# Altium project UltraZohm_Analog_ADS5272.PrjPcb (part 1 of 2)
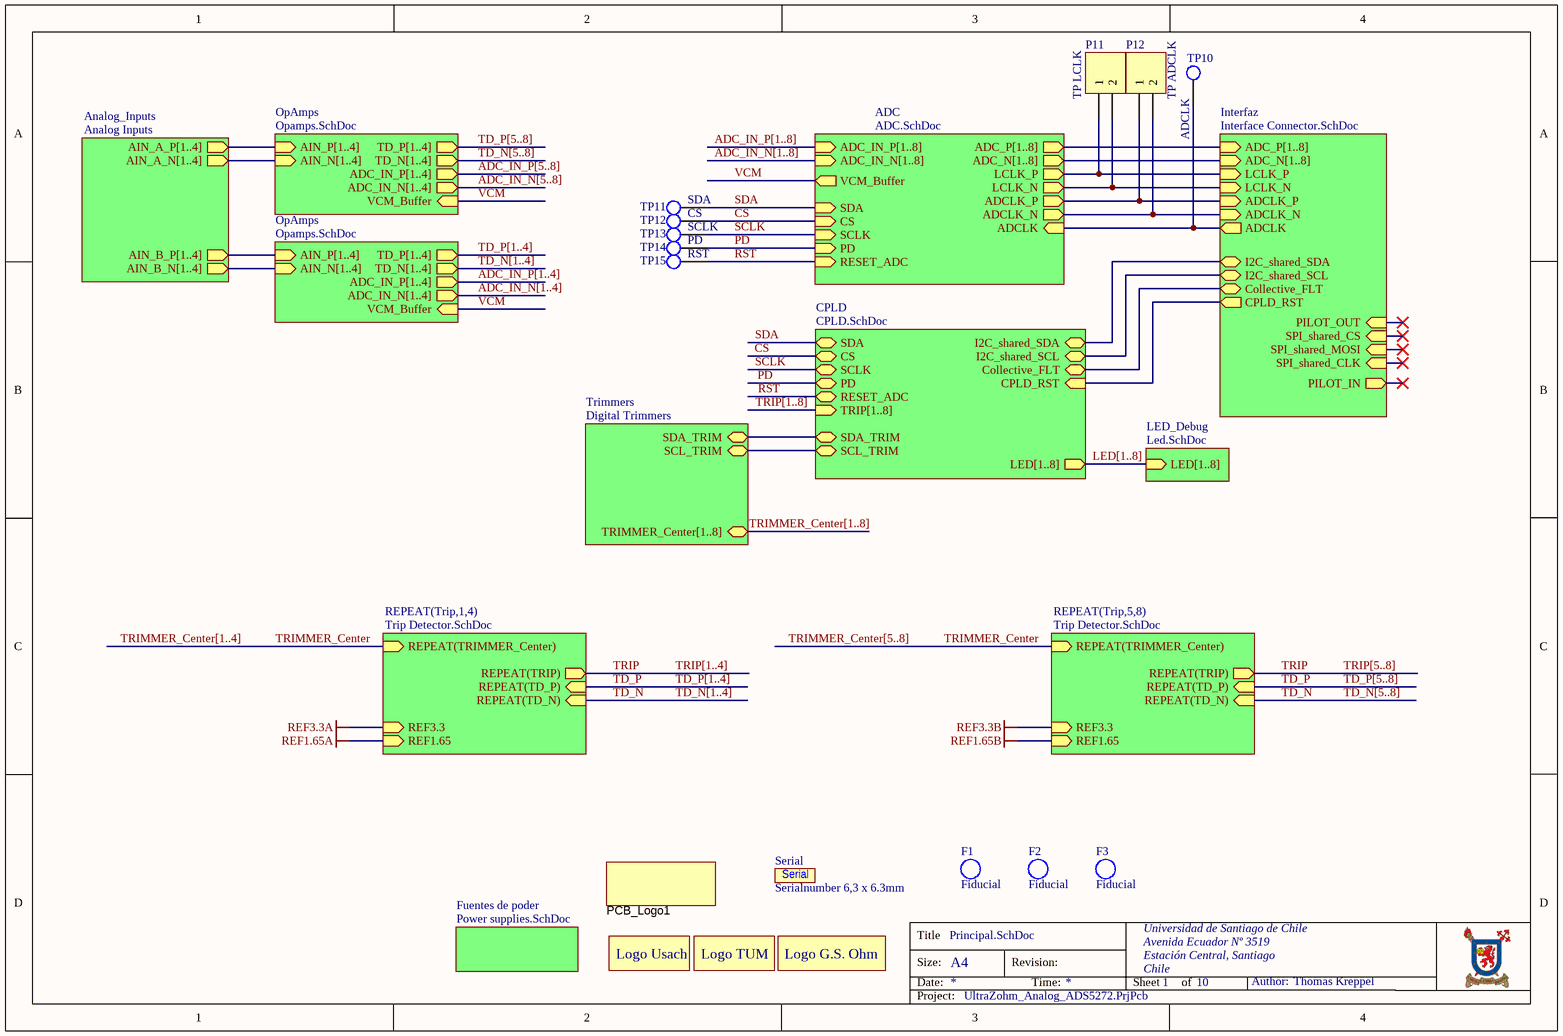
[diagram p0: Principal.SchDoc]
ProjectRevision: 3v01
10 sheets, 337 parts. Net scope: hierarchical (ports join the sheet entries above them; power ports are global).
Board file: UltraZohm_Analog_ADS5272.PcbDoc
Sheets:
  Principal.SchDoc
    ADC = ADC.SchDoc
    Fuentes de poder = Power supplies.SchDoc
    Interfaz = Interface Connector.SchDoc
    Trip1 = Trip Detector.SchDoc
    Trip2 = Trip Detector.SchDoc
    Trip3 = Trip Detector.SchDoc
    Trip4 = Trip Detector.SchDoc
    Trimmers = Digital Trimmers.SchDoc
    Analog_Inputs = Analog Inputs.SchDoc
    CPLD = CPLD.SchDoc
    LED_Debug = Led.SchDoc
    OpAmps = Opamps.SchDoc
    OpAmps = Opamps.SchDoc
    Trip5 = Trip Detector.SchDoc
    Trip6 = Trip Detector.SchDoc
    Trip7 = Trip Detector.SchDoc
    Trip8 = Trip Detector.SchDoc

## Sheet Principal.SchDoc
size A4; Author: Thomas Kreppel; CompanyName: Universidad de Santiago de Chile; Address1: Avenida Ecuador Nº 3519; Address2: Estación Central, Santiago; Address3: Chile; DocumentNumber: 1; Revision: 3v01; SheetNumber: 1; SheetTotal: 10

### Parts
F1  Fiducial  [Fiducial_1.7mm]  (no BOM)
F2  Fiducial  [Fiducial_1.7mm]  (no BOM)
F3  Fiducial  [Fiducial_1.7mm]  (no BOM)
Logo1  LOGO USACH  [Logo Usach]  (value not drawn)  (no BOM)
Logo2  LOGO TUM  [Logo TUM]  (value not drawn)  (no BOM)
Logo3  LOGO G.S. Ohm  [Logo G.S.Ohm University]  (value not drawn)  (no BOM)
P11  TP LCLK  [HDR1X2]  (no BOM)
P12  TP ADCLK  [HDR1X2]  (no BOM)
PCB_Logo1  ESD Susceptible  [ESD_Overlay_Medium]  (value not drawn)  (no BOM)
Serial  Serialnumber 6,3 x 6.3mm  [Serial_6.3x6.3mm]  (no BOM)
TP10  ADCLK  [TP_1.6mm]  (no BOM)
TP11  SDA  [TP_1.6mm]  (no BOM)
TP12  CS  [TP_1.6mm]  (no BOM)
TP13  SCLK  [TP_1.6mm]  (no BOM)
TP14  PD  [TP_1.6mm]  (no BOM)
TP15  RST  [TP_1.6mm]  (no BOM)

### Sub-sheets
ADC = ADC.SchDoc: ADCLK_P (out), LCLK_P (out), LCLK_N (out), ADCLK_N (out), ADCLK (in), SDA (in), SCLK (in), CS (in), PD (in), RESET_ADC (in), ADC_P[1..8] (out), ADC_N[1..8] (out), VCM_Buffer (out), ADC_IN_N[1..8] (in), ADC_IN_P[1..8] (in)
Analog_Inputs = Analog Inputs: AIN_B_P[1..4] (out), AIN_B_N[1..4] (out), AIN_A_P[1..4] (out), AIN_A_N[1..4] (out)
CPLD = CPLD.SchDoc: SDA_TRIM (bidir), SCL_TRIM (bidir), TRIP[1..8] (in), LED[1..8] (out), SDA (bidir), SCLK (bidir), CS (bidir), PD (bidir), RESET_ADC (bidir), Collective_FLT (bidir), I2C_shared_SDA (bidir), I2C_shared_SCL (bidir), CPLD_RST (in)
Fuentes de poder = Power supplies.SchDoc: no entries
Interfaz = Interface Connector.SchDoc: ADCLK_P (in), LCLK_P (in), LCLK_N (in), ADCLK_N (in), ADCLK (out), ADC_P[1..8] (in), ADC_N[1..8] (in), Collective_FLT (bidir), I2C_shared_SDA (bidir), I2C_shared_SCL (bidir), SPI_shared_CS (in), SPI_shared_MOSI (in), PILOT_OUT (in), PILOT_IN (out), SPI_shared_CLK (in), CPLD_RST (out)
LED_Debug = Led.SchDoc: LED[1..8] (in)
OpAmps = Opamps.SchDoc: ADC_IN_P[1..4] (out), TD_P[1..4] (out), AIN_P[1..4] (in), AIN_N[1..4] (in), ADC_IN_N[1..4] (out), TD_N[1..4] (out), VCM_Buffer (in)
OpAmps = Opamps.SchDoc: TD_P[1..4] (out), TD_N[1..4] (out), VCM_Buffer (in), AIN_N[1..4] (in), ADC_IN_N[1..4] (out), AIN_P[1..4] (in), ADC_IN_P[1..4] (out)
REPEAT(Trip,1,4) = Trip Detector.SchDoc: REPEAT(TRIMMER_Center) (in), REPEAT(TRIP) (out), REPEAT(TD_P) (in), REPEAT(TD_N) (in), REF3.3 (in), REF1.65 (in)
REPEAT(Trip,5,8) = Trip Detector.SchDoc: REPEAT(TRIMMER_Center) (in), REPEAT(TRIP) (out), REPEAT(TD_P) (in), REPEAT(TD_N) (in), REF3.3 (in), REF1.65 (in)
Trimmers = Digital Trimmers: SDA_TRIM (bidir), SCL_TRIM (bidir), TRIMMER_Center[1..8] (bidir)

### Nets
ADCLK: TP10.1 ; sheet ADC/ADCLK, sheet Interfaz/ADCLK
ADCLK_N: P12.2 ; sheet ADC/ADCLK_N, sheet Interfaz/ADCLK_N
ADCLK_P: P12.1 ; sheet ADC/ADCLK_P, sheet Interfaz/ADCLK_P
Collective_FLT: sheet Interfaz/Collective_FLT, sheet CPLD/Collective_FLT
CPLD_RST: sheet Interfaz/CPLD_RST, sheet CPLD/CPLD_RST
CS: TP12.1 ; sheet ADC/CS, sheet CPLD/CS
I2C_shared_SCL: sheet Interfaz/I2C_shared_SCL, sheet CPLD/I2C_shared_SCL
I2C_shared_SDA: sheet Interfaz/I2C_shared_SDA, sheet CPLD/I2C_shared_SDA
LCLK_N: P11.2 ; sheet ADC/LCLK_N, sheet Interfaz/LCLK_N
LCLK_P: P11.1 ; sheet ADC/LCLK_P, sheet Interfaz/LCLK_P
PD: TP14.1 ; sheet ADC/PD, sheet CPLD/PD
RST: TP15.1 ; sheet ADC/RESET_ADC, sheet CPLD/RESET_ADC  [project net RESET_ADC]
SCL_TRIM: sheet Trimmers/SCL_TRIM, sheet CPLD/SCL_TRIM
SCLK: TP13.1 ; sheet ADC/SCLK, sheet CPLD/SCLK
SDA: TP11.1 ; sheet ADC/SDA, sheet CPLD/SDA
SDA_TRIM: sheet Trimmers/SDA_TRIM, sheet CPLD/SDA_TRIM
TD_N: sheet REPEAT(Trip,1,4)/REPEAT(TD_N), sheet REPEAT(Trip,5,8)/REPEAT(TD_N)
TD_P: sheet REPEAT(Trip,1,4)/REPEAT(TD_P), sheet REPEAT(Trip,5,8)/REPEAT(TD_P)
TRIMMER_Center: sheet REPEAT(Trip,1,4)/REPEAT(TRIMMER_Center), sheet REPEAT(Trip,5,8)/REPEAT(TRIMMER_Center)
TRIP: sheet REPEAT(Trip,1,4)/REPEAT(TRIP), sheet REPEAT(Trip,5,8)/REPEAT(TRIP)
VCM: sheet ADC/VCM_Buffer, sheet OpAmps/VCM_Buffer, sheet OpAmps/VCM_Buffer  [project net VC]

### Buses and harness runs
bus ADC_IN_N[1..4] = sheet OpAmps/ADC_IN_N[1..4]
bus ADC_IN_N[1..8] = sheet ADC/ADC_IN_N[1..8]
bus ADC_IN_N[5..8] = sheet OpAmps/ADC_IN_N[1..4]
bus ADC_IN_P[1..4] = sheet OpAmps/ADC_IN_P[1..4]
bus ADC_IN_P[1..8] = sheet ADC/ADC_IN_P[1..8]
bus ADC_IN_P[5..8] = sheet OpAmps/ADC_IN_P[1..4]
bus LED[1..8] = sheet CPLD/LED[1..8] = sheet LED_Debug/LED[1..8]
bus sheet ADC/ADC_N[1..8] = sheet Interfaz/ADC_N[1..8]
bus sheet ADC/ADC_P[1..8] = sheet Interfaz/ADC_P[1..8]
bus sheet Analog_Inputs/AIN_A_N[1..4] = sheet OpAmps/AIN_N[1..4]
bus sheet Analog_Inputs/AIN_A_P[1..4] = sheet OpAmps/AIN_P[1..4]
bus sheet Analog_Inputs/AIN_B_N[1..4] = sheet OpAmps/AIN_N[1..4]
bus sheet Analog_Inputs/AIN_B_P[1..4] = sheet OpAmps/AIN_P[1..4]
bus TD_N[1..4]
bus TD_N[1..4] = sheet OpAmps/TD_N[1..4]
bus TD_N[5..8]
bus TD_N[5..8] = sheet OpAmps/TD_N[1..4]
bus TD_P[1..4]
bus TD_P[1..4] = sheet OpAmps/TD_P[1..4]
bus TD_P[5..8]
bus TD_P[5..8] = sheet OpAmps/TD_P[1..4]
bus TRIMMER_Center[1..4]
bus TRIMMER_Center[1..8] = sheet Trimmers/TRIMMER_Center[1..8]
bus TRIMMER_Center[5..8]
bus TRIP[1..4]
bus TRIP[1..8] = sheet CPLD/TRIP[1..8]
bus TRIP[5..8]

### Notes on the sheet
- Title
- Size:
- Date:
- A4
- Revision:
- Time:
- Sheet
- of
- Author:
- Project:
- (in symbol LOGO G.S. Ohm) Logo G.S. Ohm
- (in symbol LOGO TUM) Logo TUM
- (in symbol LOGO USACH) Logo Usach

### Library data of the parts
F1-F3 = Fiducial: Fiducial for Assembler
P11 P12 = Header 2: Header, 2-Pin; LatestRevisionDate: 17-Jul-2002; LatestRevisionNote: Re-released for DXP Platform.; Publisher: Altium Limited
PCB_Logo1 = LOGO_ESD_Susceptible: ESD Susceptible Symbol; Created: 2018_11_25_AGeiger; Value: ESD Susceptible
Serial = SerialNumber: Created: 2018_09_18_AGeiger; Value: Serialnumber 6,3 x 6.3mm
TP10-TP15 = TP: 1.6mm Test Point Keystone; MPN: 5006; Created: 2020_04_Kreppel; MF: Keystone; Supplier 1: Digikey; Supplier Part Number 1: 36-5006-ND
Logo1 = LOGO USACH: Supplier 2: Mouser
Logo2 = LOGO TUM: Supplier 2: Mouser
Logo3 = LOGO G.S. Ohm: Supplier 2: Mouser

## Sheet ADC.SchDoc
size A4; Author: Thomas Kreppel; CompanyName: Universidad de Santiago de Chile; Address1: Avenida Ecuador Nº 3519; Address2: Estación Central, Santiago; Address3: Chile; DocumentNumber: 6; Revision: 3v01; SheetNumber: 6; SheetTotal: 10
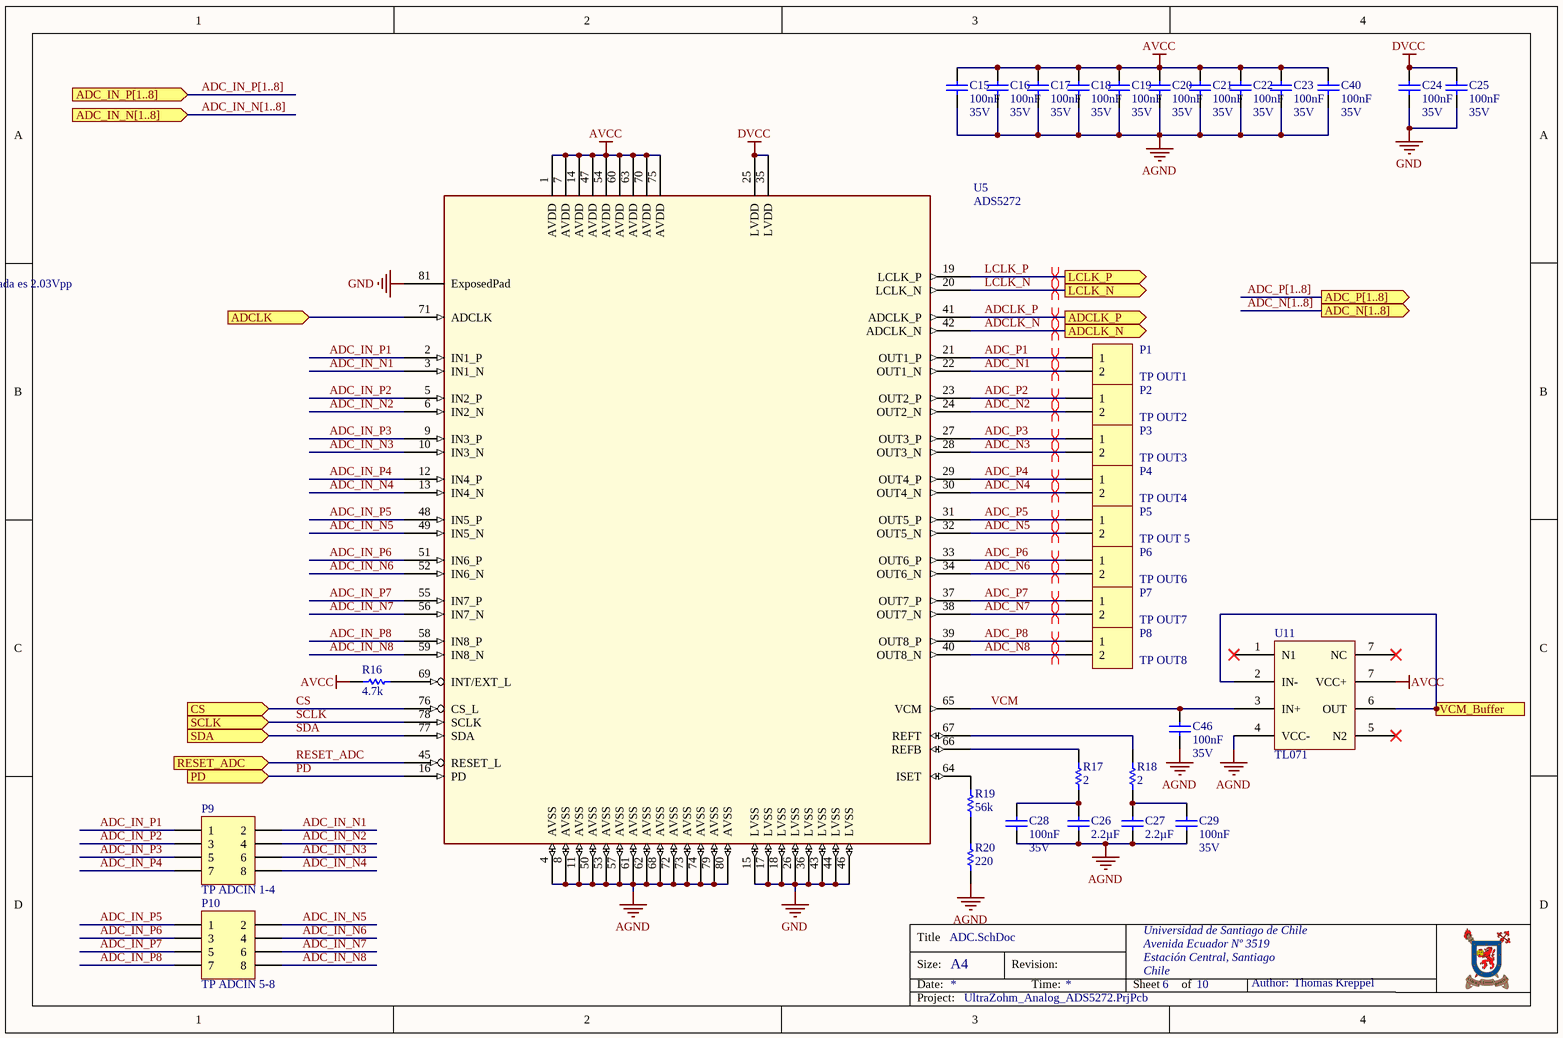
[diagram p1: ADC.SchDoc]

### Parts
C15  100nF  Voltage: 35V  [CAP_0603]
C16  100nF  Voltage: 35V  [CAP_0603]
C17  100nF  Voltage: 35V  [CAP_0603]
C18  100nF  Voltage: 35V  [CAP_0603]
C19  100nF  Voltage: 35V  [CAP_0603]
C20  100nF  Voltage: 35V  [CAP_0603]
C21  100nF  Voltage: 35V  [CAP_0603]
C22  100nF  Voltage: 35V  [CAP_0603]
C23  100nF  Voltage: 35V  [CAP_0603]
C24  100nF  Voltage: 35V  [CAP_0603]
C25  100nF  Voltage: 35V  [CAP_0603]
C26  2.2µF  [CAP_0603]
C27  2.2µF  [CAP_0603]
C28  100nF  Voltage: 35V  [CAP_0603]
C29  100nF  Voltage: 35V  [CAP_0603]
C40  100nF  Voltage: 35V  [CAP_0603]
C46  100nF  Voltage: 35V  [CAP_0603]
P1  TP OUT1  [HDR1X2]  (no BOM)
P2  TP OUT2  [HDR1X2]  (no BOM)
P3  TP OUT3  [HDR1X2]  (no BOM)
P4  TP OUT4  [HDR1X2]  (no BOM)
P5  TP OUT 5  [HDR1X2]  (no BOM)
P6  TP OUT6  [HDR1X2]  (no BOM)
P7  TP OUT7  [HDR1X2]  (no BOM)
P8  TP OUT8  [HDR1X2]  (no BOM)
P9  TP ADCIN 1-4  [HDR2X4]  (no BOM)
P10  TP ADCIN 5-8  [HDR2X4]  (no BOM)
R16  4.7k  [RES_0603]
R17  2  [RES_0603]
R18  2  [RES_0603]
R19  56k  [RES_0603]
R20  220  [RES_0603]
U5  ADS5272  [TSQFP50P1400X1400_HS-80M]
U11  TL071  [SOIC8_N]

### Ports
ADC_IN_N[1..8] (in), ADC_IN_P[1..8] (in), ADC_N[1..8] (out), ADC_P[1..8] (out), ADCLK (in), ADCLK_N (out), ADCLK_P (out), CS (in), LCLK_N (out), LCLK_P (out), PD (in), RESET_ADC (in), SCLK (in), SDA (in), VCM_Buffer (out)

### Nets
AGND: C15.2 C16.2 C17.2 C18.2 C19.2 C20.2 C21.2 C22.2 C23.2 C26.2 C27.2 C28.2 C29.2 C40.2 C46.2 R20.1 U5.4(AVSS) U5.8(AVSS) U5.11(AVSS) U5.50(AVSS) U5.53(AVSS) U5.57(AVSS) U5.61(AVSS) U5.62(AVSS) U5.68(AVSS) U5.72(AVSS) U5.73(AVSS) U5.74(AVSS) U5.79(AVSS) U5.80(AVSS) U11.4(VCC-)
AVCC: C15.1 C16.1 C17.1 C18.1 C19.1 C20.1 C21.1 C22.1 C23.1 C40.1 R16.2 U5.1(AVDD) U5.7(AVDD) U5.14(AVDD) U5.47(AVDD) U5.54(AVDD) U5.60(AVDD) U5.63(AVDD) U5.70(AVDD) U5.75(AVDD) U11.7(VCC+)
DVCC: C24.1 C25.1 U5.25(LVDD) U5.35(LVDD)
GND: C24.2 C25.2 U5.15(LVSS) U5.17(LVSS) U5.18(LVSS) U5.26(LVSS) U5.36(LVSS) U5.43(LVSS) U5.44(LVSS) U5.46(LVSS) U5.81(ExposedPad)
ADC_IN_N1: P9.2 U5.3(IN1_N)  [project net ADC_IN1_N]
ADC_IN_N2: P9.4 U5.6(IN2_N)  [project net ADC_IN2_N]
ADC_IN_N3: P9.6 U5.10(IN3_N)  [project net ADC_IN3_N]
ADC_IN_N4: P9.8 U5.13(IN4_N)  [project net ADC_IN4_N]
ADC_IN_N5: P10.2 U5.49(IN5_N)  [project net ADC_IN1_N]
ADC_IN_N6: P10.4 U5.52(IN6_N)  [project net ADC_IN2_N]
ADC_IN_N7: P10.6 U5.56(IN7_N)  [project net ADC_IN3_N]
ADC_IN_N8: P10.8 U5.59(IN8_N)  [project net ADC_IN4_N]
ADC_IN_P1: P9.1 U5.2(IN1_P)  [project net ADC_IN1_P]
ADC_IN_P2: P9.3 U5.5(IN2_P)  [project net ADC_IN2_P]
ADC_IN_P3: P9.5 U5.9(IN3_P)  [project net ADC_IN3_P]
ADC_IN_P4: P9.7 U5.12(IN4_P)  [project net ADC_IN4_P]
ADC_IN_P5: P10.1 U5.48(IN5_P)  [project net ADC_IN1_P]
ADC_IN_P6: P10.3 U5.51(IN6_P)  [project net ADC_IN2_P]
ADC_IN_P7: P10.5 U5.55(IN7_P)  [project net ADC_IN3_P]
ADC_IN_P8: P10.7 U5.58(IN8_P)  [project net ADC_IN4_P]
ADC_N1: P1.2 U5.22(OUT1_N)
ADC_N2: P2.2 U5.24(OUT2_N)
ADC_N3: P3.2 U5.28(OUT3_N)
ADC_N4: P4.2 U5.30(OUT4_N)
ADC_N5: P5.2 U5.32(OUT5_N)
ADC_N6: P6.2 U5.34(OUT6_N)
ADC_N7: P7.2 U5.38(OUT7_N)
ADC_N8: P8.2 U5.40(OUT8_N)
ADC_P1: P1.1 U5.21(OUT1_P)
ADC_P2: P2.1 U5.23(OUT2_P)
ADC_P3: P3.1 U5.27(OUT3_P)
ADC_P4: P4.1 U5.29(OUT4_P)
ADC_P5: P5.1 U5.31(OUT5_P)
ADC_P6: P6.1 U5.33(OUT6_P)
ADC_P7: P7.1 U5.37(OUT7_P)
ADC_P8: P8.1 U5.39(OUT8_P)
ADCLK: U5.71(ADCLK) ; port ADCLK
ADCLK_N: U5.42(ADCLK_N) ; port ADCLK_N
ADCLK_P: U5.41(ADCLK_P) ; port ADCLK_P
CS: U5.76(CS_L) ; port CS
LCLK_N: U5.20(LCLK_N) ; port LCLK_N
LCLK_P: U5.19(LCLK_P) ; port LCLK_P
PD: U5.16(PD) ; port PD
RESET_ADC: U5.45(RESET_L) ; port RESET_ADC
SCLK: U5.78(SCLK) ; port SCLK
SDA: U5.77(SDA) ; port SDA
VC: U11.2(IN-) U11.6(OUT) ; port VCM_Buffer
VCM: C46.1 U5.65(VCM) U11.3(IN+)
NetC26_1: C26.1 C28.1 R17.1
NetC27_1: C27.1 C29.1 R18.1
NetR16_1: R16.1 U5.69(INT/EXT_L)
NetR17_2: R17.2 U5.66(REFB)
NetR18_2: R18.2 U5.67(REFT)
NetR19_1: R19.1 R20.2
NetR19_2: R19.2 U5.64(ISET)

Not connected (* = marked no-connect by the designer): U11 1(N1)* 5(N2)*

### Buses and harness runs
bus ADC_IN_N[1..8] = port ADC_IN_N[1..8]
bus ADC_IN_P[1..8] = port ADC_IN_P[1..8]
bus ADC_N[1..8] = port ADC_N[1..8]
bus ADC_P[1..8] = port ADC_P[1..8]

### Layout directives
differential pair: ADC_N1, ADC_N2, ADC_N3, ADC_N4, ADC_N5, ADC_N6, ADC_N7, ADC_N8, ADC_P1, ADC_P2, ADC_P3, ADC_P4, ADC_P5, ADC_P6, ADC_P7, ADC_P8, ADCLK_N, ADCLK_P, LCLK_N, LCLK_P

### Notes on the sheet
- Tension diferencial máxima en la entrada es 2.03Vpp
- Title
- Size:
- Date:
- A4
- Revision:
- Time:
- Sheet
- of
- Author:
- Project:

### Library data of the parts
C15-C25 C28 C29 C40 C46 = Cap_0603: Capacitor; MPN: C0603C104M5RACTU; Rule: PcbType=ProtelPcb; MF: KEMET; Dielectricum: X7R; Tolerance: 10%; Published: 8-Jun-2000; LatestRevisionDate: 17-Jul-2002; LatestRevisionNote: Re-released for DXP Platform.; PackageReference: RAD-0.3; Publisher: Altium Limited; Value: 100nF; Supplier 1: Digikey; Supplier 2: Mouser; Supplier Part Number 1: 399-7845-1-ND; Package: 0603
C26 C27 = Cap_0603: Capacitor; MPN: C0603C225K8RACTU; Rule: PcbType=ProtelPcb; MF: KEMET; Voltage: 10V; Dielectricum: X7R; Tolerance: 10%; Published: 8-Jun-2000; LatestRevisionDate: 17-Jul-2002; LatestRevisionNote: Re-released for DXP Platform.; PackageReference: RAD-0.3; Publisher: Altium Limited; Value: 2.2µF; Supplier 1: Digikey; Supplier 2: Mouser; Supplier Part Number 1: 399-11681-1-ND; Package: 0603
P1-P8 = Header 2: Header, 2-Pin; LatestRevisionDate: 17-Jul-2002; LatestRevisionNote: Re-released for DXP Platform.; Publisher: Altium Limited
P9 P10 = Header 4X2: Header, 4-Pin, Dual row; LatestRevisionDate: 17-Jul-2002; LatestRevisionNote: Re-released for DXP Platform.; Publisher: Altium Limited
R16 = Res0603: Manufacturer Part-Number: RC0603FR-074K7L; Tolerance: 1%; Published: 8-Jun-2000; LatestRevisionDate: 17-Jul-2002; LatestRevisionNote: Re-released for DXP Platform.; PackageReference: AXIAL-0.3; Publisher: Altium Limited; PackageDescription: Axial Device, Thru-Hole; 2 Leads; 0.3 in Pin Spacing; Value: 4.7k; Supplier 1: Digikey; Supplier 2: Mouser; Supplier Part Number 1: 311-4.70KHRCT-ND; Package: 0603
R17 R18 = Res0603: Manufacturer Part-Number: RC0603FR-072RL; Tolerance: 1%; Published: 8-Jun-2000; LatestRevisionDate: 17-Jul-2002; LatestRevisionNote: Re-released for DXP Platform.; PackageReference: AXIAL-0.3; Publisher: Altium Limited; PackageDescription: Axial Device, Thru-Hole; 2 Leads; 0.3 in Pin Spacing; Value: 2; Supplier 1: Digikey; Supplier 2: Mouser; Supplier Part Number 1: 311-2.00HRCT-ND; Package: 0603
R19 = Res0603: Manufacturer Part-Number: RT0603DRD0756KL; Tolerance: 1%; Published: 8-Jun-2000; LatestRevisionDate: 17-Jul-2002; LatestRevisionNote: Re-released for DXP Platform.; PackageReference: AXIAL-0.3; Publisher: Altium Limited; PackageDescription: Axial Device, Thru-Hole; 2 Leads; 0.3 in Pin Spacing; Value: 56k; Supplier 1: Digikey; Supplier 2: Mouser; Supplier Part Number 1: 311-56KDCT-ND; Package: 0603
R20 = Res0603: Manufacturer Part-Number: RC0603JR-07220RL; Tolerance: 1%; Published: 8-Jun-2000; LatestRevisionDate: 17-Jul-2002; LatestRevisionNote: Re-released for DXP Platform.; PackageReference: AXIAL-0.3; Publisher: Altium Limited; PackageDescription: Axial Device, Thru-Hole; 2 Leads; 0.3 in Pin Spacing; Value: 220; Supplier 1: Digikey; Supplier 2: Mouser; Supplier Part Number 1: 311-220GRCT-ND; Package: 0603
U5 = ADS5272: Manufacturer Part-Number: ADS5272IPFP; Supplier 1: Digikey; Supplier 2: Mouser; Supplier Part Number 1: 296-18605-ND
U11 = TL071: IC OPAMP JFET 3MHZ 8SOIC; Manufacturer Part-Number: TL071CDR; Supplier 1: Digikey; Supplier 2: Mouser; Supplier Part Number 1: 296-14994-1-ND

## Sheet Power supplies.SchDoc
size A4; Author: Thomas Kreppel; CompanyName: Universidad de Santiago de Chile; Address1: Avenida Ecuador Nº 3519; Address2: Estación Central, Santiago; Address3: Chile; DocumentNumber: 3; Revision: 3v01; SheetNumber: 3; SheetTotal: 10
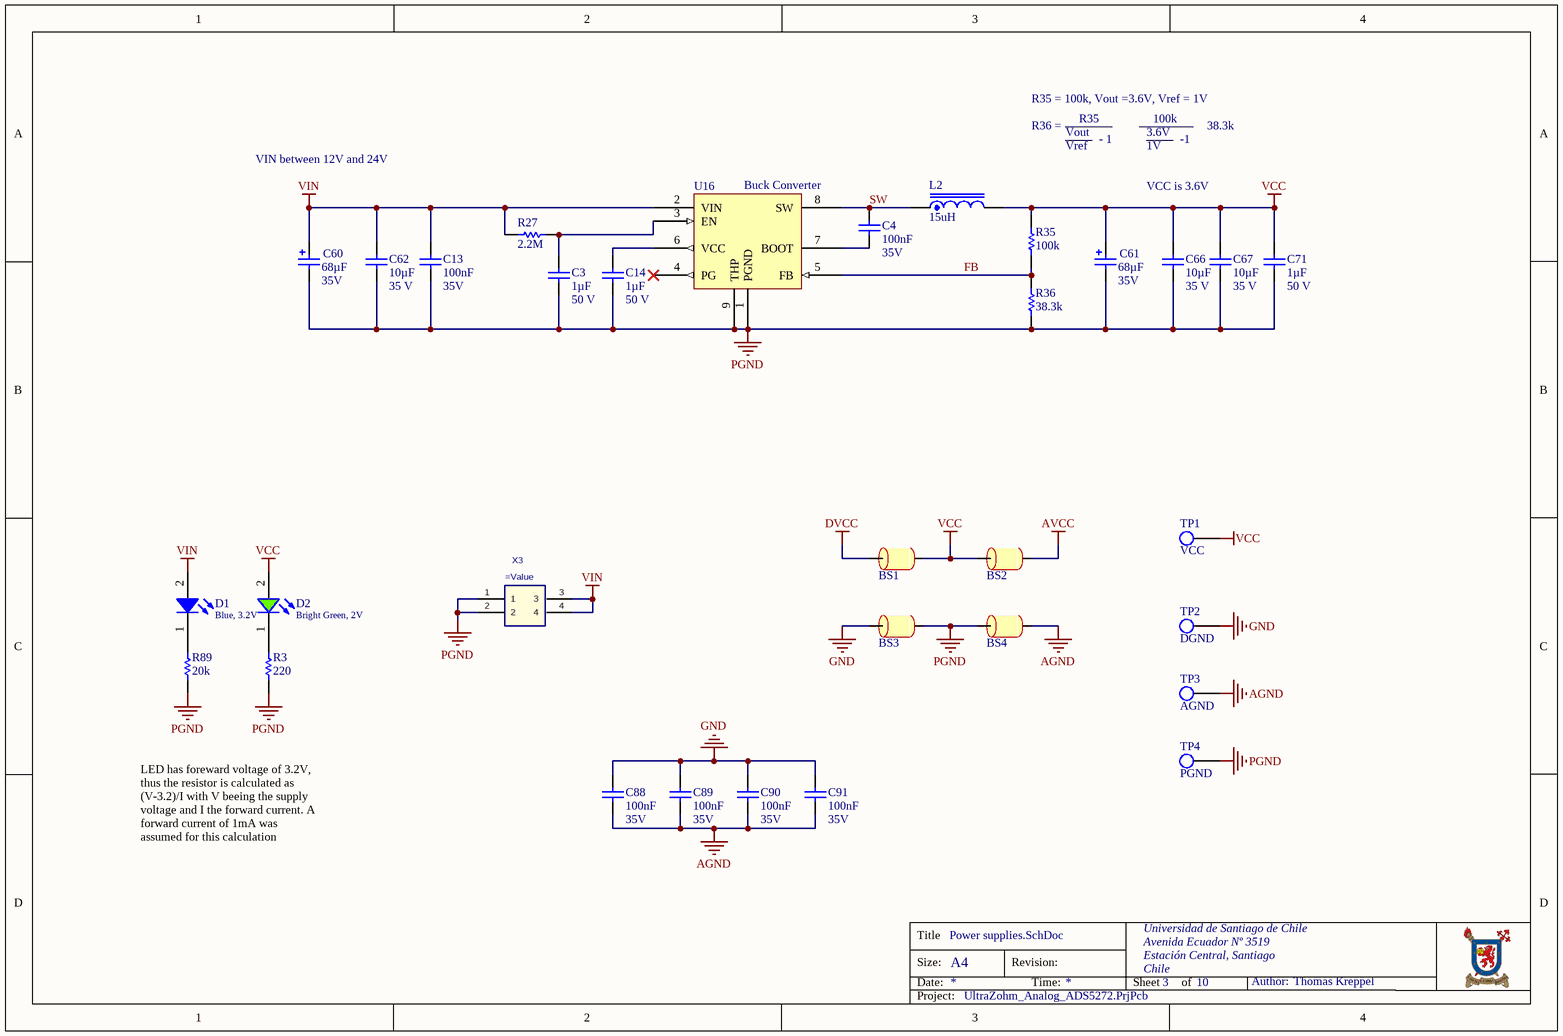
[diagram p2: Power supplies.SchDoc]

### Parts
BS1  Ferrite bead  [RES_1206]  (value not drawn)
BS2  Ferrite bead  [RES_1206]  (value not drawn)
BS3  Ferrite bead  [RES_1206]  (value not drawn)
BS4  Ferrite bead  [RES_1206]  (value not drawn)
C3  1µF  Voltage: 50 V  [CAP_0603]
C4  100nF  Voltage: 35V  [CAP_0603]
C13  100nF  Voltage: 35V  [CAP_0603]
C14  1µF  Voltage: 50 V  [CAP_0603]
C60  68µF  Voltage: 35V  [WCAP-ATG8_6.3x11]
C61  68µF  Voltage: 35V  [WCAP-ATG8_6.3x11]
C62  10µF  Voltage: 35 V  [RES_1206]
C66  10µF  Voltage: 35 V  [RES_1206]
C67  10µF  Voltage: 35 V  [RES_1206]
C71  1µF  Voltage: 50 V  [CAP_0603]
C88  100nF  Voltage: 35V  [CAP_0603]
C89  100nF  Voltage: 35V  [CAP_0603]
C90  100nF  Voltage: 35V  [CAP_0603]
C91  100nF  Voltage: 35V  [CAP_0603]
D1  Blue, 3.2V  [WL-SMCW_0603_H=0.7mm]
D2  Bright Green, 2V  [WL-SMCW_0603_H=0.7mm]
L2  15uH  [SMT_inductor_1050_Performance]
R3  220  [RES_0603]
R27  2.2M  [RES_0603]
R35  100k  [RES_0603]
R36  38.3k  [RES_0603]
R89  20k  [RES_0603]
TP1  VCC  [TP_1.6mm]  (no BOM)
TP2  DGND  [TP_1.6mm]  (no BOM)
TP3  AGND  [TP_1.6mm]  (no BOM)
TP4  PGND  [TP_1.6mm]  (no BOM)
U16  Buck Converter  [SOIC127P600X170_HS-9N]
X3  (no value)  [IPL1-102-01-L-D-K]

### Nets
AGND: BS4.2 C88.2 C89.2 C90.2 C91.2 TP3.1
AVCC: BS2.2
DVCC: BS1.1
GND: BS3.1 C88.1 C89.1 C90.1 C91.1 TP2.1
PGND: BS3.2 BS4.1 C3.2 C13.2 C14.2 C60.1(N) C61.1(N) C62.2 C66.2 C67.2 C71.2 R3.1 R36.1 R89.2 TP4.1 U16.1(PGND) U16.9(THP) X3.1 X3.2
VCC: BS1.2 BS2.1 C61.2(P) C66.1 C67.1 C71.1 D2.2(A) L2.2 R35.2 TP1.1
VIN: C13.1 C60.2(P) C62.1 D1.2(A) R27.2 U16.2(VIN) X3.3 X3.4
FB: R35.1 R36.2 U16.5(FB)
SW: C4.1 L2.1 U16.8(SW)
NetC3_1: C3.1 R27.1 U16.3(EN)
NetC4_2: C4.2 U16.7(BOOT)
NetC14_1: C14.1 U16.6(VCC)
NetD1_1: D1.1(K) R89.1
NetD2_1: D2.1(K) R3.2

Not connected (* = marked no-connect by the designer): U16 4(PG)*

### Notes on the sheet
- R35 = 100k, Vout =3.6V, Vref = 1V
- VIN between 12V and 24V
- R36 =
- Vout
- Vref
- R35
- - 1
- 3.6V
- 1V
- 100k
- -1
- 38.3k
- VCC is 3.6V
- LED has foreward voltage of 3.2V, thus the resistor is calculated as (V-3.2)/I with V beeing the supply voltage and I the forward current. A forward current of 1mA was assumed for this calculation
- Title
- Size:
- Date:
- A4
- Revision:
- Time:
- Sheet
- of
- Author:
- Project:

### Library data of the parts
BS1-BS4 = Bead: 6A; MPN: 742792121; MF: Würth Elektronik; DCR: 60mOhm; I_r: 3A; Supplier 1: Digikey; Supplier Part Number 1: 732-4654-1-ND; Package: 1206
C3 C14 C71 = Cap_0603: Capacitor Ceramic; MPN: C0603C105K3RACTU; MF: KEMET; Dielectricum: X7R; Tolerance: 10%; Value: 1µF; Supplier 1: Digikey; Supplier Part Number 1: 399-7376-1-ND; Package: 0603
C4 C13 C88-C91 = Cap_0603: as C15 on sheet ADC; Published: 8-Jun-2000; LatestRevisionDate: 17-Jul-2002; LatestRevisionNote: Re-released for DXP Platform.; PackageReference: RAD-0.3; Publisher: Altium Limited; Value: 100nF; Supplier 1: Digikey; Supplier 2: Mouser; Supplier Part Number 1: 399-7845-1-ND; Package: 0603
C60 C61 = 860010573006: WCAP-ATG8 THT Aluminum Electrolytic Capacitors, D6.3mm x L11mm, 68uF, +/-20%, 35VDC; Dissipation Factor: 12%; Endurance: 2000h; Leakage Current: 23.8uA; Ripple Current max.: 198mA; Technical Reference: ATBD110680M035DSPA4B000; ComponentLink1Description: Manufacturer; ComponentLink1URL: http://www.we-online.de; ComponentLink2Description: Datasheet; ComponentLink2URL: https://katalog.we-online.com/pbs/datasheet/860010573006.pdf; Length: 11mm; Mounting Technology: THT; Operating Temperature: -40 to +85degC; Packaging: Ammo Pack; Published Date: August 2019; Value: 68µF; Diameter: 6.3mm; Part Number: 860010573006; Publisher: Wurth Elektronik; Tolerance: +/-20%; Supplier 1: Digikey; Supplier Part Number 1: 732-8736-1-ND
C62 C66 C67 = Cap_1206: Capacitor; MPN: GRM319R6YA106KA12D; Dielectricum: X7R; Tolerance: 10%; Value: 10µF; Supplier 1: Digikey; Supplier Part Number 1: 490-9964-1-ND; MF: *; Package: 1206
D1 = 150060BS75000: WL-SMCW SMT Mono-color Chip LED Waterclear, size 0603, Blue, 3.2V, 140deg; Chip Technology: InGaN; Dominant Wavelength typ.: 470nm; Luminous Intensity typ.: 145mcd; Peak Wavelength typ.: 465nm; MF: Wurth Elektronik; Viewing Angle: 140deg; ComponentLink1Description: Manufacturer; ComponentLink1URL: http://www.we-online.de; ComponentLink2URL: https://www.we-online.com/catalog/datasheet/150060BS75000.pdf; ComponentLink2Description: Datasheet; Forward Voltage typ.: 3.2V; Emitting Color: Blue; Mounting Technology: SMT; Operating Temperature: -40 to +85degC; Published Date: December 2019; MPN: 150060BS75000; Packaging: Tape and Reel; Package: 0603; Supplier 1: Digikey; Supplier Part Number 1: 732-4966-1-ND
D2 = 150060VS75000: WL-SMCW SMT Mono-color Chip LED Waterclear, size 0603, Bright Green, 2V, 140deg; Chip Technology: AlInGaP; Dominant Wavelength typ.: 570nm; Luminous Intensity typ.: 40mcd; Peak Wavelength typ.: 572nm; MF: Wurth Elektronik; Viewing Angle: 140deg; ComponentLink1Description: Manufacturer; ComponentLink1URL: http://www.we-online.de; ComponentLink2URL: https://www.we-online.com/catalog/datasheet/150060VS75000.pdf; ComponentLink2Description: Datasheet; Forward Voltage typ.: 2V; Emitting Color: Bright Green; Mounting Technology: SMT; Operating Temperature: -40 to +85degC; Published Date: December 2019; MPN: 150060VS75000; Packaging: Tape and Reel; Package: 0603; Supplier 1: Digikey; Supplier Part Number 1: 732-4980-1-ND
L2 = B82464G4154M: SMT power Inductor, 15uH, 40m DRC; Manufacturer: Murata; Rated Current: 3.7 A; Supplier 1: Digikey; Supplier Part Number 1: 811-3837-1-ND; Value: 15uH; DCR: 40m; Supplier 2: Mouser
R3 = Res0603: as R20 on sheet ADC; Published: 8-Jun-2000; LatestRevisionDate: 17-Jul-2002; LatestRevisionNote: Re-released for DXP Platform.; PackageReference: AXIAL-0.3; Publisher: Altium Limited; PackageDescription: Axial Device, Thru-Hole; 2 Leads; 0.3 in Pin Spacing; Value: 220; Supplier 1: Digikey; Supplier 2: Mouser; Supplier Part Number 1: 311-220GRCT-ND; Package: 0603
R27 = Res0603: MPN: RC0603FR-072M2L; MF: Yageo; Tolerance: 1%; Published: 8-Jun-2000; LatestRevisionDate: 17-Jul-2002; LatestRevisionNote: Re-released for DXP Platform.; PackageReference: AXIAL-0.3; Publisher: Altium Limited; PackageDescription: Axial Device, Thru-Hole; 2 Leads; 0.3 in Pin Spacing; Value: 2.2M; Supplier 1: Digikey; Supplier Part Number 1: YAG3329CT-ND; Package: 0603
R35 = Res0603: MPN: RC0603FR-07100KL; MF: Yageo; Tolerance: 1%; Published: 8-Jun-2000; LatestRevisionDate: 17-Jul-2002; LatestRevisionNote: Re-released for DXP Platform.; PackageReference: AXIAL-0.3; Publisher: Altium Limited; PackageDescription: Axial Device, Thru-Hole; 2 Leads; 0.3 in Pin Spacing; Value: 100k; Supplier 1: Digikey; Supplier Part Number 1: 311-100KHRCT-ND; Package: 0603
R36 = Res0603: Tolerance: 1%; Published: 8-Jun-2000; LatestRevisionDate: 17-Jul-2002; LatestRevisionNote: Re-released for DXP Platform.; PackageReference: AXIAL-0.3; Publisher: Altium Limited; PackageDescription: Axial Device, Thru-Hole; 2 Leads; 0.3 in Pin Spacing; Value: 38.3k; Supplier 1: Digikey; Supplier 2: Mouser; Supplier Part Number 1: 311-38.3KHRCT-ND; Package: 0603
R89 = Res0603: Manufacturer Part-Number: RC0603FR-07330RL; Tolerance: 1%; Published: 8-Jun-2000; LatestRevisionDate: 17-Jul-2002; LatestRevisionNote: Re-released for DXP Platform.; PackageReference: AXIAL-0.3; Publisher: Altium Limited; PackageDescription: Axial Device, Thru-Hole; 2 Leads; 0.3 in Pin Spacing; Value: 20k; Supplier 1: Digikey; Supplier 2: Mouser; Supplier Part Number 1: 311-330HRCT-ND; Package: 0603
TP1-TP4 = TP: 1.6mm Test Point Keystone; Manufacturer: Keystone Electronics; MPN: 5006; Created: 2020_04_Kreppel; Supplier 1: Digikey; Supplier Part Number 1: 36-5006-ND; Supplier 2: Mouser; MF: Keystone
U16 = LMR33620A: 3.8V to 36V, 2A synchronous step-down converter; Manufacturer: Texas Instruments; Manufacturer Part-Number: LMR33620ADDA; Switching frequency: 400kHz; Created: 4/20 Kreppel; Supplier 1: Digikey; Supplier Part Number 1: 296-48841-ND; Supplier 2: Mouser
X3 = IPL1-102-XX-X-D-X: 2.54mm Double Row Terminal Assembly, Right-Angled; Manufacturer: SAMTEC; Created: 2018_05_02_AGeiger; Value: =MPN; Supplier 2: Mouser; Supplier Part Number 1: SAM10565-ND; Supplier 1: Digikey

## Sheet Interface Connector.SchDoc
size A4; Author: Thomas Kreppel; CompanyName: Universidad de Santiago de Chile; Address1: Avenida Ecuador Nº 3519; Address2: Estación Central, Santiago; Address3: Chile; DocumentNumber: 2; Revision: 3v01; SheetNumber: 2; SheetTotal: 10
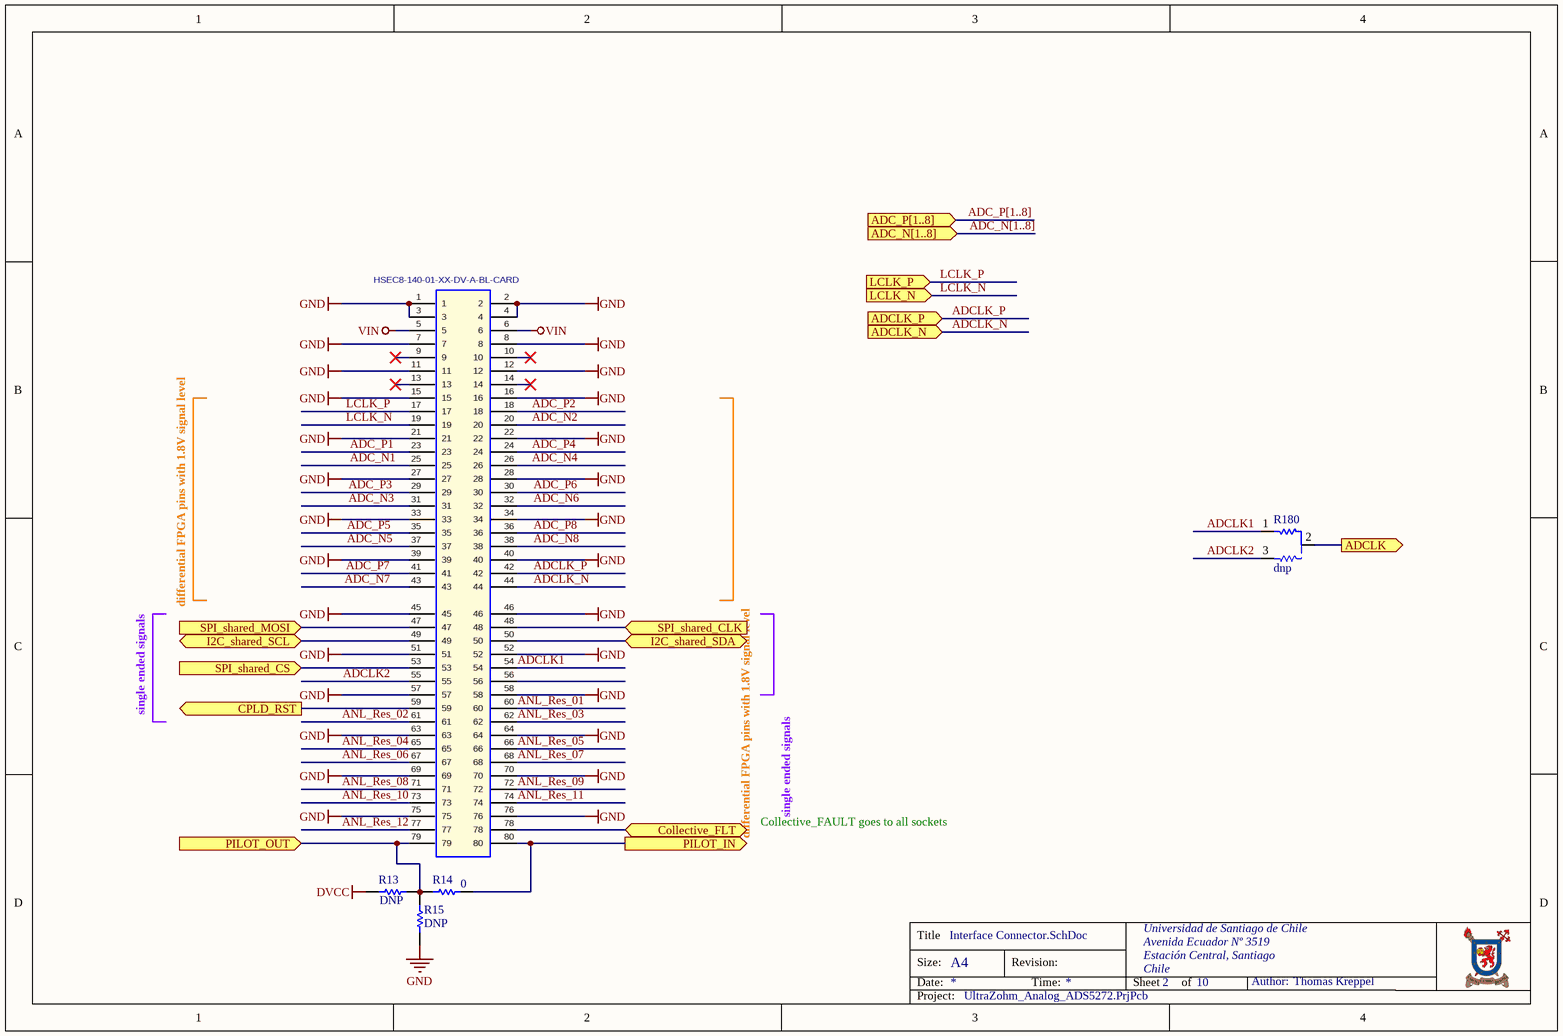
[diagram p3: Interface Connector.SchDoc]

### Parts
R13  DNP  [RES_0603]  (no BOM)
R14  0  [RES_0603]
R15  DNP  [RES_0603]  (no BOM)
R180  dnp  [0603_Config]  (no BOM)
X2  HSEC8-140-01-XX-DV-A-BL-CARD  [HSEC8-140-01-XX-DV-A-BL-CARD]  (no BOM)

### Ports
ADC_N[1..8] (in), ADC_P[1..8] (in), ADCLK (out), ADCLK_N (in), ADCLK_P (in), Collective_FLT (bidir), CPLD_RST (out), I2C_shared_SCL (bidir), I2C_shared_SDA (bidir), LCLK_N (in), LCLK_P (in), PILOT_IN (out), PILOT_OUT (in), SPI_shared_CLK (in), SPI_shared_CS (in), SPI_shared_MOSI (in)

### Nets
DVCC: R13.2
GND: R15.2 X2.1 X2.2 X2.3 X2.4 X2.7 X2.8 X2.11 X2.12 X2.15 X2.16 X2.21 X2.22 X2.27 X2.28 X2.33 X2.34 X2.39 X2.40 X2.45 X2.46 X2.51 X2.52 X2.57 X2.58 X2.63 X2.64 X2.69 X2.70 X2.75 X2.76
VIN: X2.5 X2.6
ADC_N1: X2.25
ADC_N2: X2.20
ADC_N3: X2.31
ADC_N4: X2.26
ADC_N5: X2.37
ADC_N6: X2.32
ADC_N7: X2.43
ADC_N8: X2.38
ADC_P1: X2.23
ADC_P2: X2.18
ADC_P3: X2.29
ADC_P4: X2.24
ADC_P5: X2.35
ADC_P6: X2.30
ADC_P7: X2.41
ADC_P8: X2.36
ADCLK: R180.2 ; port ADCLK
ADCLK1: R180.1 X2.54
ADCLK2: R180.3 X2.55
ADCLK_N: X2.44 ; port ADCLK_N
ADCLK_P: X2.42 ; port ADCLK_P
ANL_Res_01: X2.60
ANL_Res_02: X2.61
ANL_Res_03: X2.62
ANL_Res_04: X2.65
ANL_Res_05: X2.66
ANL_Res_06: X2.67
ANL_Res_07: X2.68
ANL_Res_08: X2.71
ANL_Res_09: X2.72
ANL_Res_10: X2.73
ANL_Res_11: X2.74
ANL_Res_12: X2.77
Collective_FLT: X2.78 ; port Collective_FLT
CPLD_RST: X2.59 ; port CPLD_RST
I2C_shared_SCL: X2.49 ; port I2C_shared_SCL
I2C_shared_SDA: X2.50 ; port I2C_shared_SDA
LCLK_N: X2.19 ; port LCLK_N
LCLK_P: X2.17 ; port LCLK_P
PILOT_IN: R14.1 X2.80 ; port PILOT_IN
PILOT_OUT: R13.1 R14.2 R15.1 X2.79 ; port PILOT_OUT
SPI_shared_CLK: X2.48 ; port SPI_shared_CLK
SPI_shared_CS: X2.53 ; port SPI_shared_CS
SPI_shared_MOSI: X2.47 ; port SPI_shared_MOSI

Not connected (* = marked no-connect by the designer): X2 9* 10* 13* 14* 56

### Buses and harness runs
bus ADC_N[1..8] = port ADC_N[1..8]
bus ADC_P[1..8] = port ADC_P[1..8]

### Notes on the sheet
- differential FPGA pins with 1.8V signal level
- single ended signals
- Collective_FAULT goes to all sockets
- Title
- Size:
- Date:
- A4
- Revision:
- Time:
- Sheet
- of
- Author:
- Project:

### Library data of the parts
R13 R15 = Res0603: Manufacturer Part-Number: RC0603JR-070RL; Value: 0; Tolerance: 1%; Published: 8-Jun-2000; LatestRevisionDate: 17-Jul-2002; LatestRevisionNote: Re-released for DXP Platform.; PackageReference: AXIAL-0.3; Publisher: Altium Limited; PackageDescription: Axial Device, Thru-Hole; 2 Leads; 0.3 in Pin Spacing; Supplier 1: Digikey; Supplier 2: Mouser; Supplier Part Number 1: 311-0.0GRCT-ND; Package: 0603
R14 = Res0603: Manufacturer Part-Number: RC0603JR-070RL; Tolerance: 1%; Published: 8-Jun-2000; LatestRevisionDate: 17-Jul-2002; LatestRevisionNote: Re-released for DXP Platform.; PackageReference: AXIAL-0.3; Publisher: Altium Limited; PackageDescription: Axial Device, Thru-Hole; 2 Leads; 0.3 in Pin Spacing; Value: 0; Supplier 1: Digikey; Supplier 2: Mouser; Supplier Part Number 1: 311-0.0GRCT-ND; Package: 0603
R180 = R_config: Solder 0603 resistor/jumper between pads 1 and 2 for standard function. Solter resistor between pads 2 and 3 for alternative function; MPN: MCWR06X1002FTL; Value: 10k; MF: Multicomp; Voltage: 50V; Power: 100mW; Tolerance: 1%; Created: 2018_09_04_AGeiger; Package: 0603; Supplier Part Number 1: 2447230; Supplier 1: Farnell
X2 = HSEC8-140-01-XX-DV-A-BL-CARD: Mating Card Layout for HSEC8-140-01-XX-DV-A-BL; Manufacturer: SAMTEC; Created: 2018_04_23_AGeiger; Value: HSEC8-140-01-XX-DV-A-BL-CARD; Supplier 2: Mouser

## Sheet Trip Detector.SchDoc
size A4; Author: Thomas Kreppel; CompanyName: Universidad de Santiago de Chile; Address1: Avenida Ecuador Nº 3519; Address2: Estación Central, Santiago; Address3: Chile; DocumentNumber: 9; Revision: 3v01; SheetNumber: 9; SheetTotal: 10
Used 8 times, as channels Trip1, Trip2, Trip3, Trip4, Trip5, Trip6, Trip7, Trip8. Parts and nets are listed once, with the designators drawn on the sheet.
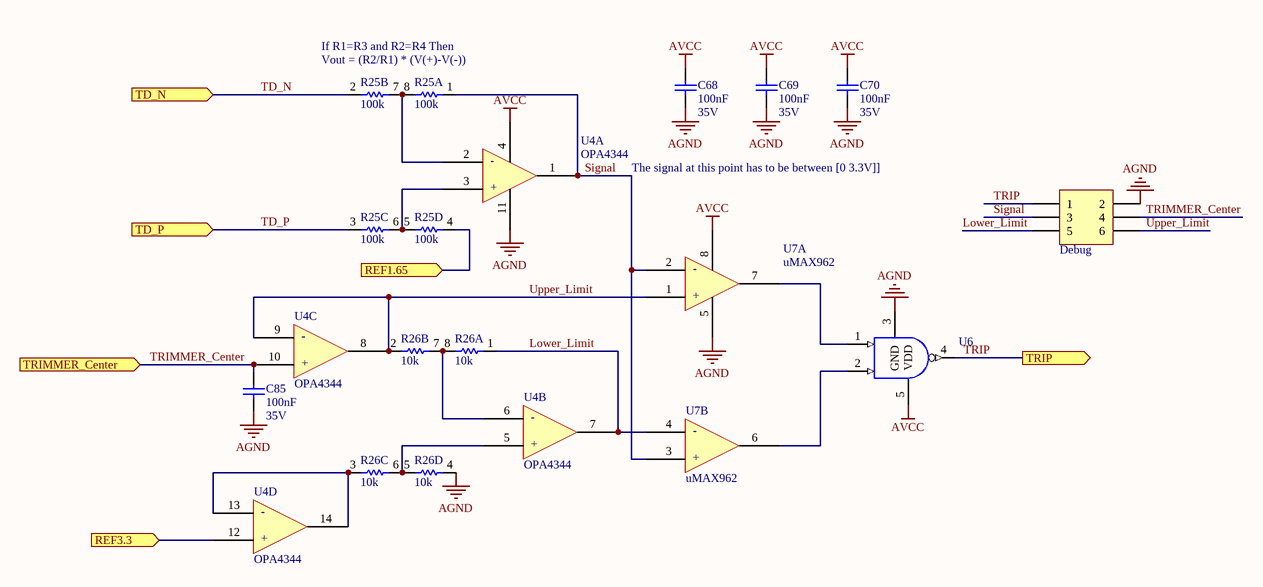
[diagram p4: Trip Detector.SchDoc]

### Parts
C68  100nF  Voltage: 35V  [CAP_0603]
C69  100nF  Voltage: 35V  [CAP_0603]
C70  100nF  Voltage: 35V  [CAP_0603]
C85  100nF  Voltage: 35V  [CAP_0603]
Debug  Connector Header Through Hole, Right Angle 6 position 0.0.79" (2mm)  [Header 3x2 Macho Pitch 1.27mm]  (value not drawn)  (no BOM)
R25  100k  [CAC-80P320X160-8N]  (parts A,B,C,D of 4)
R26  10k  [CAC-80P320X160-8N]  (parts A,B,C,D of 4)
U4  OPA4344  [TSSO5X6-G14/X.3]  (parts A,B,C,D of 4)
U6  MC74VHC1G00DFT1  [SOT-353]  (value not drawn)
U7  uMAX962  [8-MSOP]  (parts A,B of 2)

### Ports
REF1.65 (in), REF3.3 (in), TD_N (in), TD_P (in), TRIMMER_Center (in), TRIP (out)

### Nets
AGND: C68.2 C69.2 C70.2 C85.2 Debug.2 R26.4 U4.11(v-) U6.3(GND) U7.5(GND)
AVCC: C68.1 C69.1 C70.1 U4.4(v+) U6.5(VDD) U7.8(VCC)
Lower_Limit: Debug.5 R26.1 U4.7(out_b) U7.4(-IN_B)
REF1.65: R25.4 ; port REF1.65
REF3.3: U4.12(+in_d) ; port REF3.3
Signal: Debug.3 R25.1 U4.1(out_a) U7.2(-in_a) U7.3(+IN_B)
TD_N: R25.2 ; port TD_N
TD_P: R25.3 ; port TD_P
TRIMMER_Center: C85.1 Debug.4 U4.10(+in_c) ; port TRIMMER_Center
TRIP: Debug.1 U6.4(~{Y}) ; port TRIP
Upper_Limit: Debug.6 R26.2 U4.8(out_c) U4.9(-in_c) U7.1(+in_a)
NetR25_5: R25.5 R25.6 U4.3(+in_a)
NetR25_7: R25.7 R25.8 U4.2(-in_a)
NetR26_3: R26.3 U4.13(-in_d) U4.14(out_d)
NetR26_5: R26.5 R26.6 U4.5(+in_b)
NetR26_7: R26.7 R26.8 U4.6(-in_b)
NetU6_1: U6.1(B) U7.7(out_a)
NetU6_2: U6.2(A) U7.6(OUT_B)

### Channels
Trip1: designators end in A; ports REF1.65=REF1.65A REF3.3=REF3.3A TD_N=TD1_N TD_P=TD1_P TRIMMER_Center=TRIMMER_Center TRIP=TRIP
Trip2: designators end in B; ports REF1.65=REF1.65A REF3.3=REF3.3A TD_N=TD2_N TD_P=TD2_P TRIMMER_Center=TRIMMER_Center TRIP=TRIP
Trip3: designators end in C; ports REF1.65=REF1.65A REF3.3=REF3.3A TD_N=TD3_N TD_P=TD3_P TRIMMER_Center=TRIMMER_Center TRIP=TRIP
Trip4: designators end in D; ports REF1.65=REF1.65A REF3.3=REF3.3A TD_N=TD4_N TD_P=TD4_P TRIMMER_Center=TRIMMER_Center TRIP=TRIP
Trip5: designators end in E; ports REF1.65=REF1.65B REF3.3=REF3.3B TD_N=TD1_N TD_P=TD1_P TRIMMER_Center=TRIMMER_Center TRIP=TRIP
Trip6: designators end in F; ports REF1.65=REF1.65B REF3.3=REF3.3B TD_N=TD2_N TD_P=TD2_P TRIMMER_Center=TRIMMER_Center TRIP=TRIP
Trip7: designators end in G; ports REF1.65=REF1.65B REF3.3=REF3.3B TD_N=TD3_N TD_P=TD3_P TRIMMER_Center=TRIMMER_Center TRIP=TRIP
Trip8: designators end in H; ports REF1.65=REF1.65B REF3.3=REF3.3B TD_N=TD4_N TD_P=TD4_P TRIMMER_Center=TRIMMER_Center TRIP=TRIP

### Notes on the sheet
- (near R25) If R1=R3 and R2=R4 Then
- (near R25) Vout = (R2/R1) * (V(+)-V(-))
- The signal at this point has to be between [0 3.3V]]
- Title
- Size:
- Date:
- A4
- Revision:
- Time:
- Sheet
- of
- Author:
- Project:
- (in symbol MAX962, part A) -; +
- (in symbol MAX962, part B) -; +
- (in symbol OPA4344, part A) -; +
- (in symbol OPA4344, part B) -; +
- (in symbol OPA4344, part C) -; +
- (in symbol OPA4344, part D) -; +

### Library data of the parts
C68-C70 C85 = Cap_0603: as C15 on sheet ADC; Published: 8-Jun-2000; LatestRevisionDate: 17-Jul-2002; LatestRevisionNote: Re-released for DXP Platform.; PackageReference: RAD-0.3; Publisher: Altium Limited; Value: 100nF; Supplier 1: Digikey; Supplier 2: Mouser; Supplier Part Number 1: 399-7845-1-ND; Package: 0603
Debug = Header 3x2 Macho_Pitch_1.27mm: Connector Header Through Hole 6 position 0.050" (1.27mm); Manufacturer Part-Number: GRPB032VWVN-RC; Supplier 1: Digikey; Supplier 2: Mouser; Supplier Part Number 1: S9015E-03-ND
R25 = ResArray 1206: Chip Resistor Array 0606, 4xR; Manufacturer: Vishay; Value: 100k; Created: Kreppel_0420; Supplier 1: Digikey; Supplier Part Number 1: 749-1032-1-ND; Supplier 2: Mouser
R26 = ResArray 1206: Chip Resistor Array 0606, 4xR; Manufacturer: Vishay; Manufacturer Part-Number: ACASA1002S1002P100; Value: 10k; Created: Kreppel_0420; Supplier 1: Digikey; Supplier Part Number 1: 749-1023-1-ND; Supplier 2: Mouser
U4 = OPA4344: opamp rai to rail 1mV; Manufacturer Part-Number: OPA4344EA/250; Supplier 1: Digikey; Supplier 2: Mouser; Supplier Part Number 1: OPA4344EACT-ND
U6 = MC74VHC1G00DFT1: 2-Input NAND Gate; Manufacturer Part-Number: MC74VHC1G00DFT1G; Published: 15-Apr-2002; LatestRevisionDate: 12-Dec-2006; LatestRevisionNote: IPC-7351 Footprint Added.; DatasheetVersion: Dec-1999; PackageVersion: Oct-1999; PackageReference: 419A-01; Publisher: Altium Limited; PackageDescription: 5-Pin SOT-353 Package 0.65 mm Pitch, 2.1 mm Lead Span; ComponentLink1Description: Manufacturer Link; ComponentLink1URL: http://www.onsemi.com/; ComponentLink2Description: Datasheet; ComponentLink2URL: http://www.onsemi.com/pub/Collateral/MC74VHC1G00-D.PDF; Supplier 1: Digikey; Supplier 2: Mouser; Supplier Part Number 1: MC74VHC1G00DFT1GOSCT-ND
U7 = MAX962: IC COMPARATOR BTR 8-UMAX; Manufacturer Part-Number: MAX962EUA+; Supplier 1: Digikey; Supplier 2: Mouser; Supplier Part Number 1: MAX962EUA+-ND

## Sheet Digital Trimmers.SchDoc
size A4; Author: Thomas Kreppel; CompanyName: Universidad de Santiago de Chile; Address1: Avenida Ecuador Nº 3519; Address2: Estación Central, Santiago; Address3: Chile; DocumentNumber: 8; Revision: 3v01; SheetNumber: 8; SheetTotal: 10
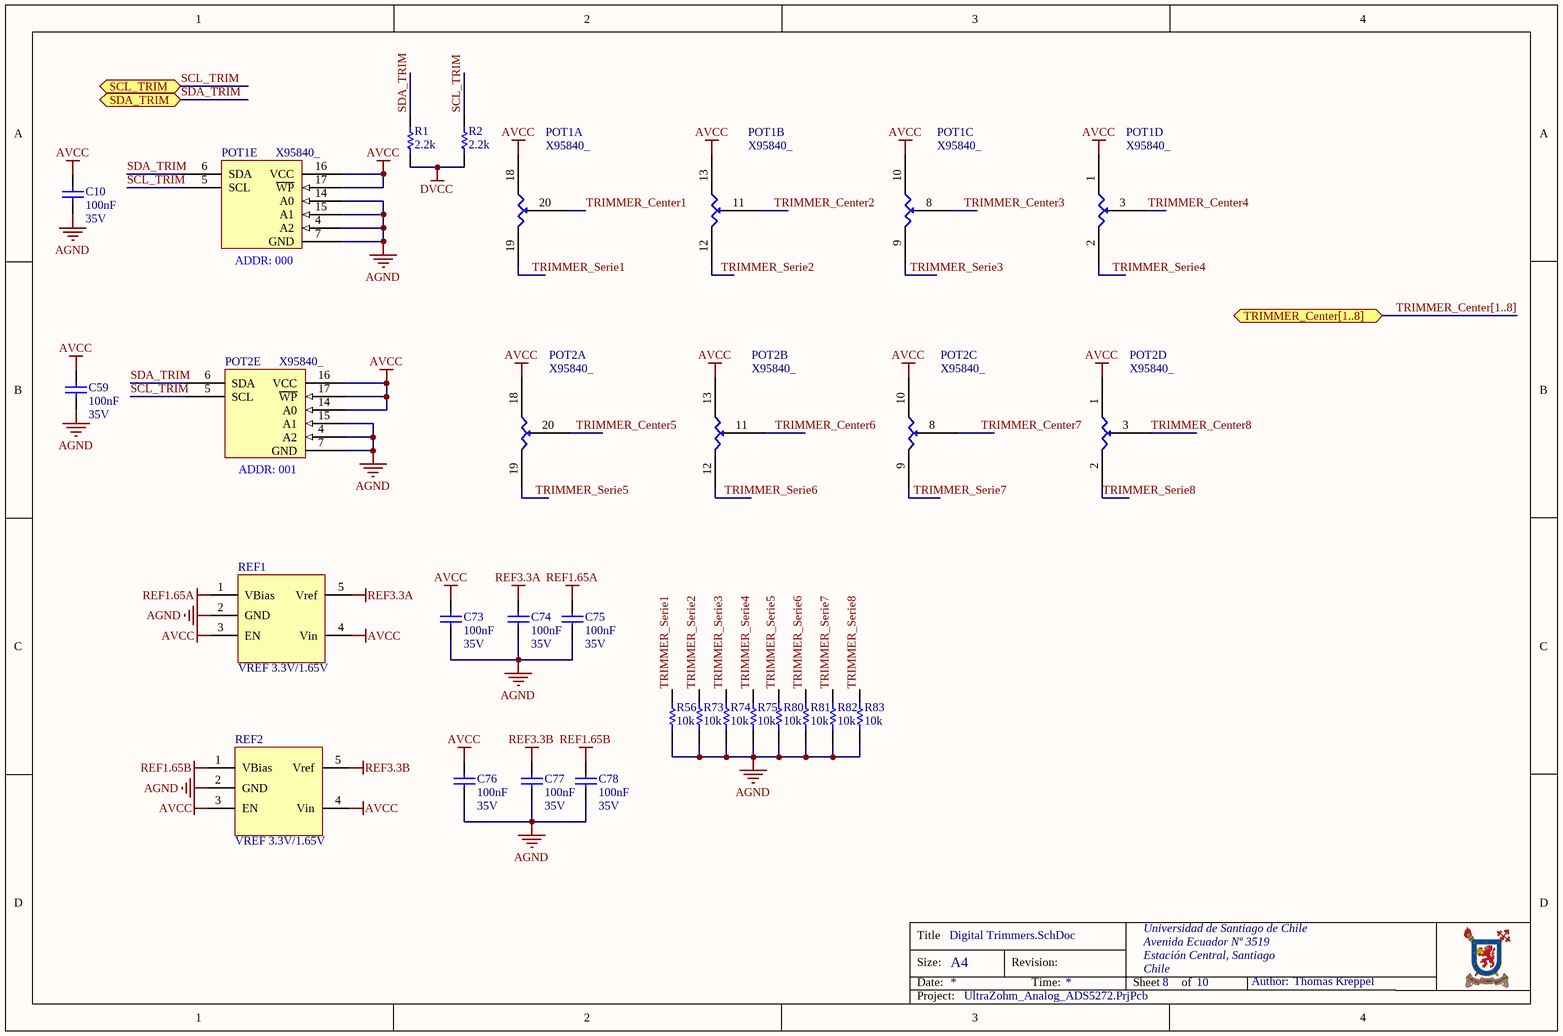
[diagram p5: Digital Trimmers.SchDoc]

### Parts
C10  100nF  Voltage: 35V  [CAP_0603]
C59  100nF  Voltage: 35V  [CAP_0603]
C73  100nF  Voltage: 35V  [CAP_0603]
C74  100nF  Voltage: 35V  [CAP_0603]
C75  100nF  Voltage: 35V  [CAP_0603]
C76  100nF  Voltage: 35V  [CAP_0603]
C77  100nF  Voltage: 35V  [CAP_0603]
C78  100nF  Voltage: 35V  [CAP_0603]
POT1  X95840_  [TSSO6X6-G20/D6.6]  (parts A,B,C,D,E of 5)
POT2  X95840_  [TSSO6X6-G20/D6.6]  (parts A,B,C,D,E of 5)
R1  2.2k  [RES_0603]
R2  2.2k  [RES_0603]
R56  10k  [RES_0603]
R73  10k  [RES_0603]
R74  10k  [RES_0603]
R75  10k  [RES_0603]
R80  10k  [RES_0603]
R81  10k  [RES_0603]
R82  10k  [RES_0603]
R83  10k  [RES_0603]
REF1  VREF 3.3V/1.65V  [SOT-23-5]
REF2  VREF 3.3V/1.65V  [SOT-23-5]

### Ports
SCL_TRIM (bidir), SDA_TRIM (bidir), TRIMMER_Center[1..8] (bidir)

### Nets
AGND: C10.2 C59.2 C73.2 C74.2 C75.2 C76.2 C77.2 C78.2 POT1.4(A2) POT1.7(GND) POT1.14(A0) POT1.15(A1) POT2.4(A2) POT2.7(GND) POT2.15(A1) R56.1 R73.1 R74.1 R75.1 R80.1 R81.1 R82.1 R83.1 REF1.2(GND) REF2.2(GND)
AVCC: C10.1 C59.1 C73.1 C76.1 POT1.1(RH3) POT1.10(RH2) POT1.13(RH1) POT1.16(VCC) POT1.17(~{WP}) POT1.18 POT2.1(RH3) POT2.10(RH2) POT2.13(RH1) POT2.14(A0) POT2.16(VCC) POT2.17(~{WP}) POT2.18 REF1.3(EN) REF1.4(Vin) REF2.3(EN) REF2.4(Vin)
DVCC: R1.1 R2.1
REF1.65A: C75.1 REF1.1(VBias)
REF1.65B: C78.1 REF2.1(VBias)
REF3.3A: C74.1 REF1.5(Vref)
REF3.3B: C77.1 REF2.5(Vref)
SCL_TRIM: POT1.5(SCL) POT2.5(SCL) R2.2 ; port SCL_TRIM
SDA_TRIM: POT1.6(SDA) POT2.6(SDA) R1.2 ; port SDA_TRIM
TRIMMER_Center1: POT1.20  [project net TRIMMER_Center]
TRIMMER_Center2: POT1.11(RW1)  [project net TRIMMER_Center]
TRIMMER_Center3: POT1.8(RW2)  [project net TRIMMER_Center]
TRIMMER_Center4: POT1.3(RW3)  [project net TRIMMER_Center]
TRIMMER_Center5: POT2.20  [project net TRIMMER_Center]
TRIMMER_Center6: POT2.11(RW1)  [project net TRIMMER_Center]
TRIMMER_Center7: POT2.8(RW2)  [project net TRIMMER_Center]
TRIMMER_Center8: POT2.3(RW3)  [project net TRIMMER_Center]
TRIMMER_Serie1: POT1.19 R56.2
TRIMMER_Serie2: POT1.12(RL1) R73.2
TRIMMER_Serie3: POT1.9(RL2) R74.2
TRIMMER_Serie4: POT1.2(RL3) R75.2
TRIMMER_Serie5: POT2.19 R80.2
TRIMMER_Serie6: POT2.12(RL1) R81.2
TRIMMER_Serie7: POT2.9(RL2) R82.2
TRIMMER_Serie8: POT2.2(RL3) R83.2

### Buses and harness runs
bus TRIMMER_Center[1..8] = port TRIMMER_Center[1..8]

### Notes on the sheet
- (near POT1) ADDR: 000
- (near POT2) ADDR: 001
- Title
- Size:
- Date:
- A4
- Revision:
- Time:
- Sheet
- of
- Author:
- Project:

### Library data of the parts
C10 C59 C73-C78 = Cap_0603: as C15 on sheet ADC; Published: 8-Jun-2000; LatestRevisionDate: 17-Jul-2002; LatestRevisionNote: Re-released for DXP Platform.; PackageReference: RAD-0.3; Publisher: Altium Limited; Value: 100nF; Supplier 1: Digikey; Supplier 2: Mouser; Supplier Part Number 1: 399-7845-1-ND; Package: 0603
POT1 POT2 = X95840_: Digital Trimmer; Manufacturer Part-Number: X95840WV20IZ-2.7; Supplier 1: Digikey; Supplier 2: Mouser; Supplier Part Number 1: X95840WV20IZ-2.7-ND
R1 R2 = Res0603: MPN: RC0603FR-072K2L; Tolerance: 1%; Published: 8-Jun-2000; LatestRevisionDate: 17-Jul-2002; LatestRevisionNote: Re-released for DXP Platform.; PackageReference: AXIAL-0.3; Publisher: Altium Limited; PackageDescription: Axial Device, Thru-Hole; 2 Leads; 0.3 in Pin Spacing; Value: 2.2k; Supplier 1: Digikey; Supplier 2: Mouser; Supplier Part Number 1: 311-2.20KHRCT-ND; Package: 0603
R56 R73-R75 R80-R83 = Res0603: Manufacturer Part-Number: RT0603DRD0710KL; Tolerance: 1%; Published: 8-Jun-2000; LatestRevisionDate: 17-Jul-2002; LatestRevisionNote: Re-released for DXP Platform.; PackageReference: AXIAL-0.3; Publisher: Altium Limited; PackageDescription: Axial Device, Thru-Hole; 2 Leads; 0.3 in Pin Spacing; Value: 10k; Supplier 1: Digikey; Supplier 2: Mouser; Supplier Part Number 1: 311-10KDCT-ND; Package: 0603
REF1 REF2 = VREF 3.3V/1.65V: Manufacturer Part-Number: REF2033AIDDCT; Supplier 1: Digikey; Supplier 2: Mouser; Supplier Part Number 1: 296-40487-1-ND

## Sheet Analog Inputs.SchDoc
size A4; Author: Thomas Kreppel; CompanyName: Universidad de Santiago de Chile; Address1: Avenida Ecuador Nº 3519; Address2: Estación Central, Santiago; Address3: Chile; DocumentNumber: 4; Revision: 3v01; SheetNumber: 4; SheetTotal: 10
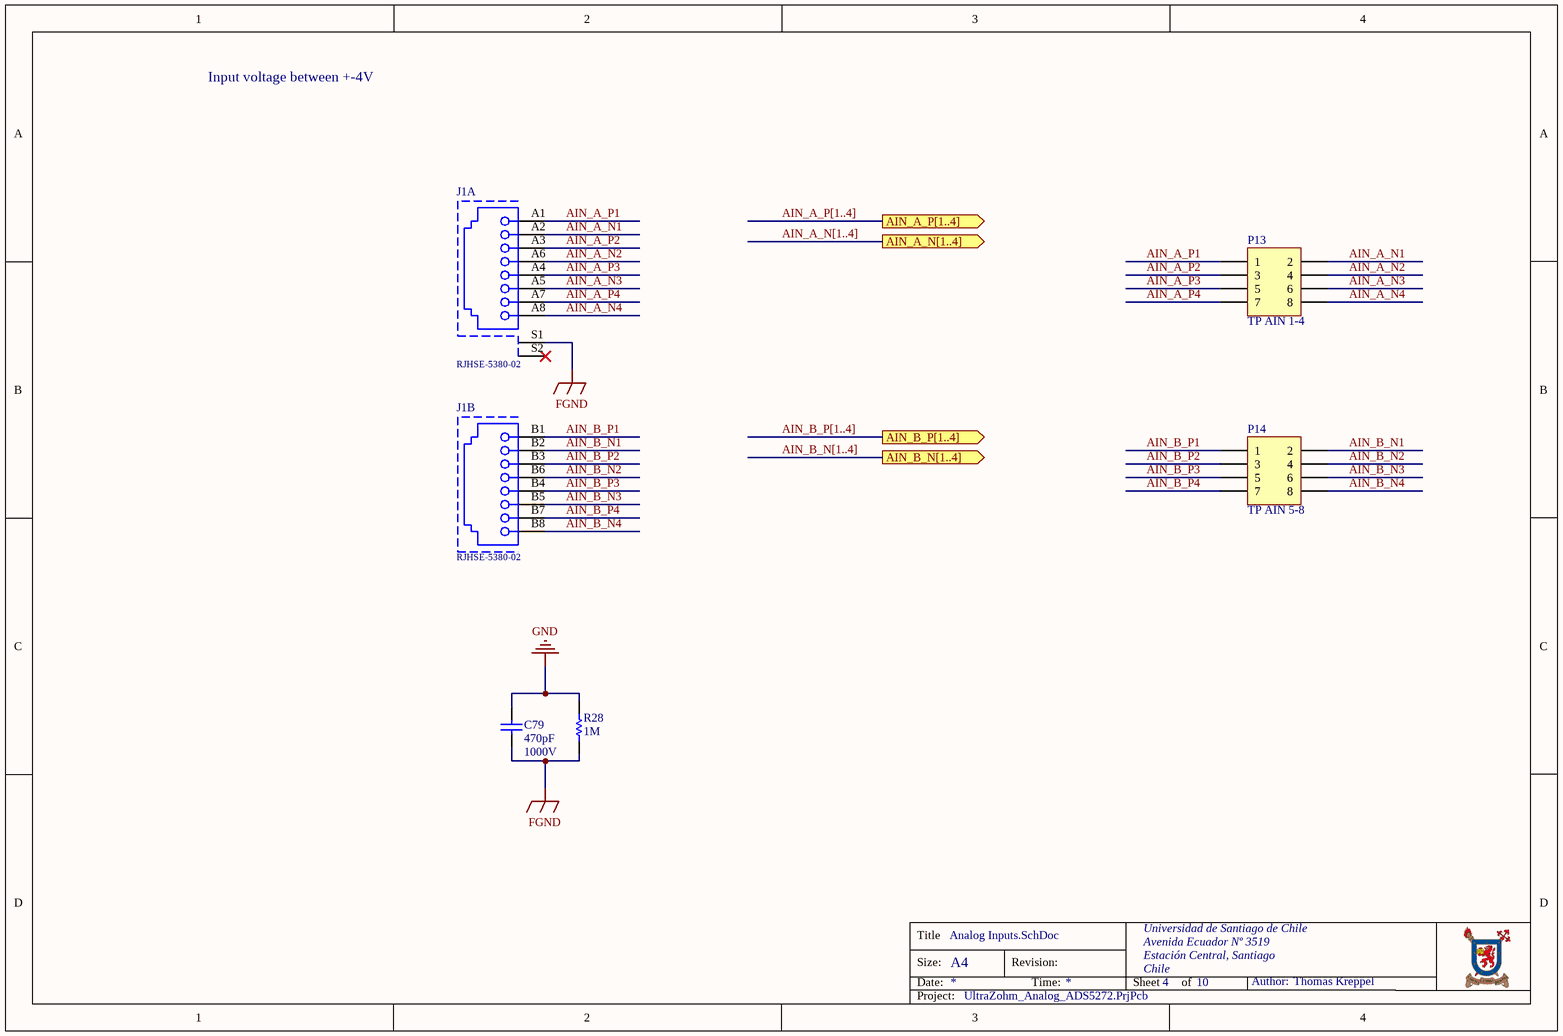
[diagram p6: Analog Inputs.SchDoc]

### Parts
C79  470pF  Voltage: 1000V  [RES_1206]
J1  RJHSE-5380-02  [RJHSE-5380-02]  (parts A,B of 2)
P13  TP AIN 1-4  [HDR2X4]  (no BOM)
P14  TP AIN 5-8  [HDR2X4]  (no BOM)
R28  1M  [RES_1206]

### Ports
AIN_A_N[1..4] (out), AIN_A_P[1..4] (out), AIN_B_N[1..4] (out), AIN_B_P[1..4] (out)

### Nets
FGND: C79.2 J1.S1 R28.1
GND: C79.1 R28.2
AIN_A_N1: J1.A2 P13.2  [project net AIN1_N]
AIN_A_N2: J1.A6 P13.4  [project net AIN2_N]
AIN_A_N3: J1.A5 P13.6  [project net AIN3_N]
AIN_A_N4: J1.A8 P13.8  [project net AIN4_N]
AIN_A_P1: J1.A1 P13.1  [project net AIN1_P]
AIN_A_P2: J1.A3 P13.3  [project net AIN2_P]
AIN_A_P3: J1.A4 P13.5  [project net AIN3_P]
AIN_A_P4: J1.A7 P13.7  [project net AIN4_P]
AIN_B_N1: J1.B2 P14.2  [project net AIN1_N]
AIN_B_N2: J1.B6 P14.4  [project net AIN2_N]
AIN_B_N3: J1.B5 P14.6  [project net AIN3_N]
AIN_B_N4: J1.B8 P14.8  [project net AIN4_N]
AIN_B_P1: J1.B1 P14.1  [project net AIN1_P]
AIN_B_P2: J1.B3 P14.3  [project net AIN2_P]
AIN_B_P3: J1.B4 P14.5  [project net AIN3_P]
AIN_B_P4: J1.B7 P14.7  [project net AIN4_P]

Not connected (* = marked no-connect by the designer): J1 S2*

### Buses and harness runs
bus AIN_A_N[1..4] = port AIN_A_N[1..4]
bus AIN_A_P[1..4] = port AIN_A_P[1..4]
bus AIN_B_N[1..4] = port AIN_B_N[1..4]
bus AIN_B_P[1..4] = port AIN_B_P[1..4]

### Notes on the sheet
- Input voltage between +-4V
- Title
- Size:
- Date:
- A4
- Revision:
- Time:
- Sheet
- of
- Author:
- Project:

### Library data of the parts
C79 = Cap_1206: Capacitor; MPN: 885342208017; MF: Würth Elektronik; Dielectricum: X7R; Tolerance: 10%; Supplier Part Number 1: 732-12097-1-ND; Value: 470pF; Supplier 1: Digikey; Package: 1206
J1 = RJHSE-5380-02: Modular Jack WR-MJ, Tab Up, Shielded, Dual Port, Righ Angle, THT, 8P8C; Manufacturer: Amphenol; Port: 1x2; Entrance: Right Angle; Compliance: Lead free / RoHS; Rated Current: 1.5 A; Working Voltage: 120 VAC; Withstanding Voltage: 1000 VAC; Contact Resistance: 20 mOhm; ComponentLink1Description: Manufacturer; ComponentLink1URL: http://www.we-online.de; ComponentLink2Description: Datasheet; ComponentLink2URL: https://katalog.we-online.de/em/datasheet/615016137621.pdf; Published Date: July 2018; Pin Number: 8P8C; Operating Temperature: -40 to 85 degC; Mounting Technology: THT; Packaging: Tray; Supplier 1: Digikey; Supplier Part Number 1: RJHSE-5380-02-ND; Supplier 2: Mouser; Manufacturer Part-Number: RJHSE-5380-02; Supplier Part Number 2: 523-RJHSE-5380-02
P13 P14 = Header 4X2: Header, 4-Pin, Dual row; LatestRevisionDate: 17-Jul-2002; LatestRevisionNote: Re-released for DXP Platform.; Publisher: Altium Limited
R28 = Res1206: Resistor; Manufacturer Part-Number: CRCW12101M00JNEA; Tolerance: 1%; Value: 1M; Supplier 2: Mouser; Supplier 1: Digikey; Supplier Part Number 1: 541-1.0MVCT-ND; Package: 1206

## Sheet CPLD.SchDoc
size A4; Author: Thomas Kreppel; CompanyName: Universidad de Santiago de Chile; Address1: Avenida Ecuador Nº 3519; Address2: Estación Central, Santiago; Address3: Chile; DocumentNumber: 7; Revision: 3v01; SheetNumber: 7; SheetTotal: 10
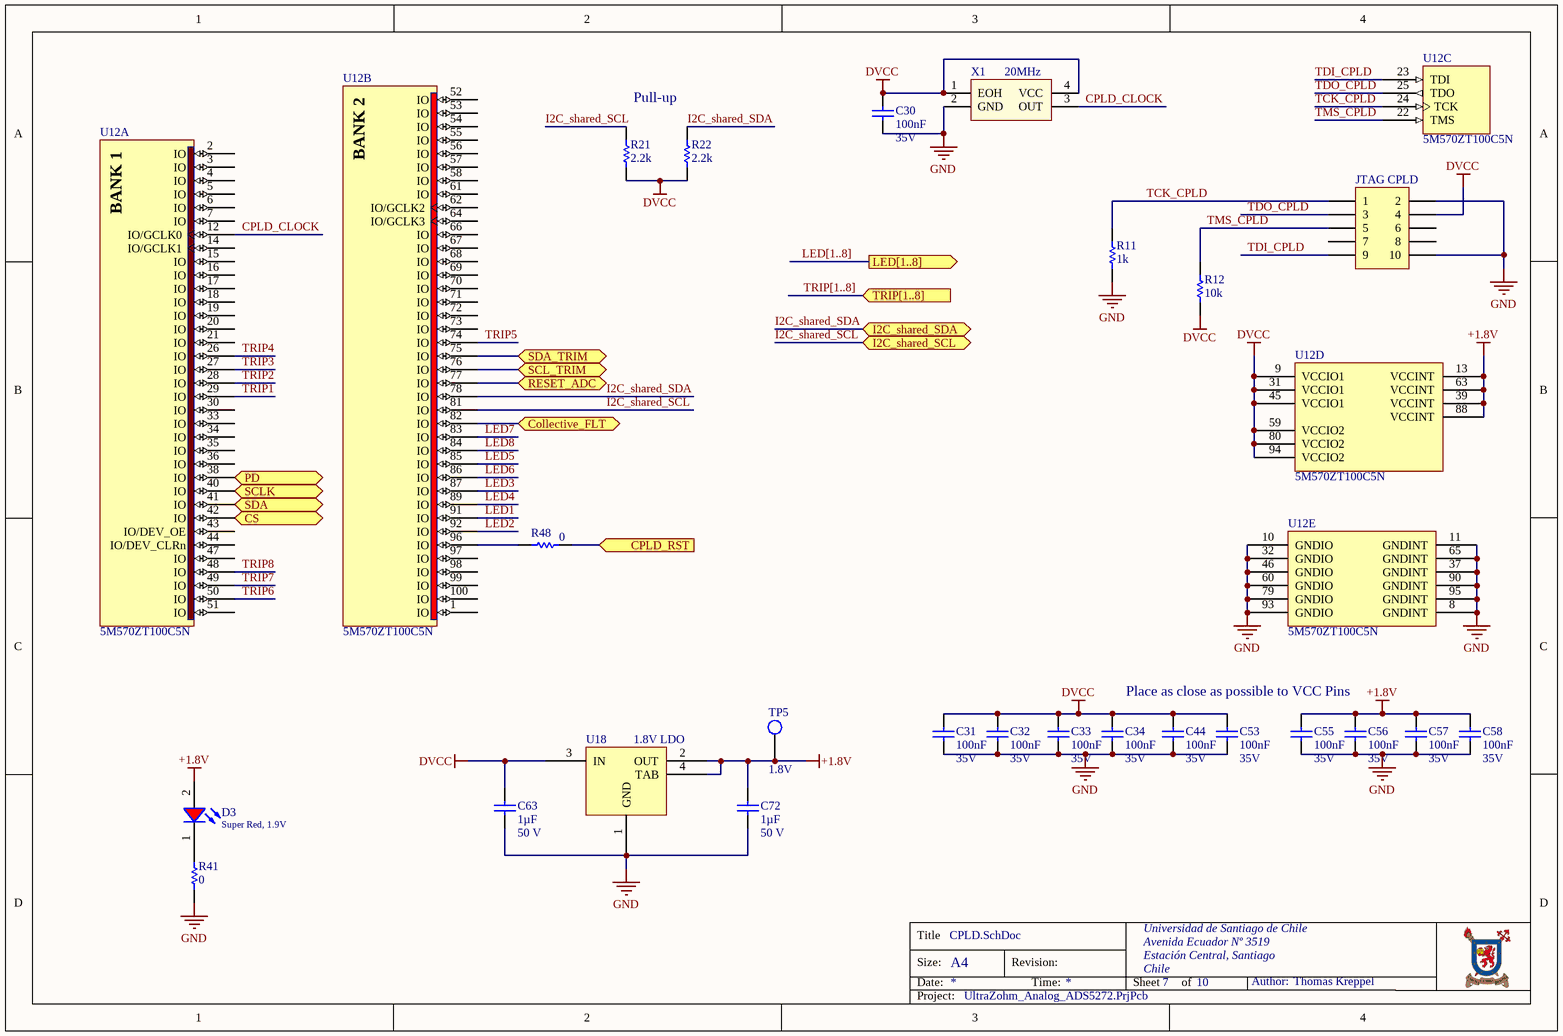
[diagram p7: CPLD.SchDoc]

### Parts
C30  100nF  Voltage: 35V  [CAP_0603]
C31  100nF  Voltage: 35V  [CAP_0603]
C32  100nF  Voltage: 35V  [CAP_0603]
C33  100nF  Voltage: 35V  [CAP_0603]
C34  100nF  Voltage: 35V  [CAP_0603]
C44  100nF  Voltage: 35V  [CAP_0603]
C53  100nF  Voltage: 35V  [CAP_0603]
C55  100nF  Voltage: 35V  [CAP_0603]
C56  100nF  Voltage: 35V  [CAP_0603]
C57  100nF  Voltage: 35V  [CAP_0603]
C58  100nF  Voltage: 35V  [CAP_0603]
C63  1µF  Voltage: 50 V  [CAP_0603]
C72  1µF  Voltage: 50 V  [CAP_0603]
D3  Super Red, 1.9V  [WL-SMCW_0603_H=0.7mm]
JTAG_CPLD  (no value)  [HEADER_JTAG - MAXII Horizontal]
R11  1k  [RES_0603]
R12  10k  [RES_0603]
R21  2.2k  [RES_0603]
R22  2.2k  [RES_0603]
R41  0  [RES_0603]
R48  0  [RES_0603]
TP5  1.8V  [TP_1.6mm]  (no BOM)
U12  5M570ZT100C5N  [TQFP100_N]  (parts A,B,C,D,E of 5)
U18  1.8V LDO  [SOT230P700X170-4N]
X1  20MHz  [CRYSTALOSC]

### Ports
Collective_FLT (bidir), CPLD_RST (in), CS (bidir), I2C_shared_SCL (bidir), I2C_shared_SDA (bidir), LED[1..8] (out), PD (bidir), RESET_ADC (bidir), SCL_TRIM (bidir), SCLK (bidir), SDA (bidir), SDA_TRIM (bidir), TRIP[1..8] (in)

### Nets
+1.8V: C55.1 C56.1 C57.1 C58.1 C72.1 D3.2(A) TP5.1 U12.13(VCCINT) U12.39(VCCINT) U12.63(VCCINT) U12.88(VCCINT) U18.2(OUT) U18.4(TAB)
DVCC: C30.1 C31.1 C32.1 C33.1 C34.1 C44.1 C53.1 C63.1 JTAG_CPLD.4 R12.1 R21.1 R22.1 U12.9(VCCIO1) U12.31(VCCIO1) U12.45(VCCIO1) U12.59(VCCIO2) U12.80(VCCIO2) U12.94(VCCIO2) U18.3(IN) X1.1(EOH) X1.4(VCC)
GND: C30.2 C31.2 C32.2 C33.2 C34.2 C44.2 C53.2 C55.2 C56.2 C57.2 C58.2 C63.2 C72.2 JTAG_CPLD.2 JTAG_CPLD.10 R11.1 R41.1 U12.8(GNDINT) U12.10(GNDIO) U12.11(GNDINT) U12.32(GNDIO) U12.37(GNDINT) U12.46(GNDIO) U12.60(GNDIO) U12.65(GNDINT) U12.79(GNDIO) U12.90(GNDINT) U12.93(GNDIO) U12.95(GNDINT) U18.1(GND) X1.2(GND)
Collective_FLT: U12.82(IO) ; port Collective_FLT
CPLD_CLOCK: U12.12(IO/GCLK0) X1.3(OUT)
CPLD_RST: R48.1 ; port CPLD_RST
CS: U12.42(IO) ; port CS
I2C_shared_SCL: R21.2 U12.81(IO) ; port I2C_shared_SCL
I2C_shared_SDA: R22.2 U12.78(IO) ; port I2C_shared_SDA
LED1: U12.91(IO)
LED2: U12.92(IO)
LED3: U12.87(IO)
LED4: U12.89(IO)
LED5: U12.85(IO)
LED6: U12.86(IO)
LED7: U12.83(IO)
LED8: U12.84(IO)
PD: U12.38(IO) ; port PD
RESET_ADC: U12.77(IO) ; port RESET_ADC
SCL_TRIM: U12.76(IO) ; port SCL_TRIM
SCLK: U12.40(IO) ; port SCLK
SDA: U12.41(IO) ; port SDA
SDA_TRIM: U12.75(IO) ; port SDA_TRIM
TCK_CPLD: JTAG_CPLD.1 R11.2 U12.24(TCK)
TDI_CPLD: JTAG_CPLD.9 U12.23(TDI)
TDO_CPLD: JTAG_CPLD.3 U12.25(TDO)
TMS_CPLD: JTAG_CPLD.5 R12.2 U12.22(TMS)
TRIP1: U12.29(IO)  [project net TRIP]
TRIP2: U12.28(IO)  [project net TRIP]
TRIP3: U12.27(IO)  [project net TRIP]
TRIP4: U12.26(IO)  [project net TRIP]
TRIP5: U12.74(IO)  [project net TRIP]
TRIP6: U12.50(IO)  [project net TRIP]
TRIP7: U12.49(IO)  [project net TRIP]
TRIP8: U12.48(IO)  [project net TRIP]
NetD3_1: D3.1(K) R41.2
NetR48_2: R48.2 U12.96(IO)

Not connected (* = marked no-connect by the designer): JTAG_CPLD 6 7 8; U12 1(IO) 2(IO) 3(IO) 4(IO) 5(IO) 6(IO) 7(IO) 14(IO/GCLK1) 15(IO) 16(IO) 17(IO) 18(IO) 19(IO) 20(IO) 21(IO) 30(IO) 33(IO) 34(IO) 35(IO) 36(IO) 43(IO/DEV_OE) 44(IO/DEV_CLRn) 47(IO) 51(IO) 52(IO) 53(IO) 54(IO) 55(IO) 56(IO) 57(IO) 58(IO) 61(IO) 62(IO/GCLK2) 64(IO/GCLK3) 66(IO) 67(IO) 68(IO) 69(IO) 70(IO) 71(IO) 72(IO) 73(IO) 97(IO) 98(IO) 99(IO) 100(IO)

### Buses and harness runs
bus LED[1..8] = port LED[1..8]
bus TRIP[1..8] = port TRIP[1..8]

### Notes on the sheet
- Pull-up
- Place as close as possible to VCC Pins
- Title
- Size:
- Date:
- A4
- Revision:
- Time:
- Sheet
- of
- Author:
- Project:
- (in symbol 5M570ZT100C5N, part A) BANK 1
- (in symbol 5M570ZT100C5N, part B) BANK 2

### Library data of the parts
C30-C34 C44 C53 C55-C58 = Cap_0603: as C15 on sheet ADC; Published: 8-Jun-2000; LatestRevisionDate: 17-Jul-2002; LatestRevisionNote: Re-released for DXP Platform.; PackageReference: RAD-0.3; Publisher: Altium Limited; Value: 100nF; Supplier 1: Digikey; Supplier 2: Mouser; Supplier Part Number 1: 399-7845-1-ND; Package: 0603
C63 C72 = Cap_0603: as C3 on sheet Power supplies; Value: 1µF; Supplier 1: Digikey; Supplier Part Number 1: 399-7376-1-ND; Package: 0603
D3 = 150060SS75000: WL-SMCW SMT Mono-color Chip LED Waterclear, size 0603, Super Red, 1.9V, 140deg; Chip Technology: AlInGaP; Dominant Wavelength typ.: 630nm; Luminous Intensity typ.: 60mcd; Peak Wavelength typ.: 645nm; MF: Wurth Elektronik; Viewing Angle: 140deg; ComponentLink1Description: Manufacturer; ComponentLink1URL: http://www.we-online.de; ComponentLink2URL: https://www.we-online.com/catalog/datasheet/150060SS75000.pdf; ComponentLink2Description: Datasheet; Forward Voltage typ.: 1.9V; Emitting Color: Super Red; Mounting Technology: SMT; Operating Temperature: -40 to +85degC; Published Date: December 2019; MPN: 150060SS75000; Packaging: Tape and Reel; Package: 0603; Supplier 1: Digikey; Supplier Part Number 1: 732-4979-1-ND
JTAG_CPLD = Header JTAG_MAXII: Header, 5-Pin, Dual row, Vertical; Manufacturer Part-Number: 61201021721; LatestRevisionDate: 17-Jul-2002; LatestRevisionNote: Re-released for DXP Platform.; Publisher: Altium Limited; Supplier 1: Digikey; Supplier 2: Mouser; Supplier Part Number 1: 732-2098-ND
R11 = Res0603: MPN: RC0603FR-071KL; Tolerance: 1%; Published: 8-Jun-2000; LatestRevisionDate: 17-Jul-2002; LatestRevisionNote: Re-released for DXP Platform.; PackageReference: AXIAL-0.3; Publisher: Altium Limited; PackageDescription: Axial Device, Thru-Hole; 2 Leads; 0.3 in Pin Spacing; Value: 1k; Supplier 1: Digikey; Supplier 2: Mouser; Supplier Part Number 1: 311-1.00KHRCT-ND; Package: 0603
R12 = Res0603: as R56 on sheet Digital Trimmers; Published: 8-Jun-2000; LatestRevisionDate: 17-Jul-2002; LatestRevisionNote: Re-released for DXP Platform.; PackageReference: AXIAL-0.3; Publisher: Altium Limited; PackageDescription: Axial Device, Thru-Hole; 2 Leads; 0.3 in Pin Spacing; Value: 10k; Supplier 1: Digikey; Supplier 2: Mouser; Supplier Part Number 1: 311-10KDCT-ND; Package: 0603
R21 R22 = Res0603: MPN: RC0603FR-072K2L; Tolerance: 1%; Published: 8-Jun-2000; LatestRevisionDate: 17-Jul-2002; LatestRevisionNote: Re-released for DXP Platform.; PackageReference: AXIAL-0.3; Publisher: Altium Limited; PackageDescription: Axial Device, Thru-Hole; 2 Leads; 0.3 in Pin Spacing; Value: 2.2k; Supplier 1: Digikey; Supplier 2: Mouser; Supplier Part Number 1: 311-2.20KHRCT-ND; Package: 0603
R41 R48 = Res0603: Manufacturer Part-Number: CRCW06030000Z0EA; Tolerance: 1%; Published: 8-Jun-2000; LatestRevisionDate: 17-Jul-2002; LatestRevisionNote: Re-released for DXP Platform.; PackageReference: AXIAL-0.3; Publisher: Altium Limited; PackageDescription: Axial Device, Thru-Hole; 2 Leads; 0.3 in Pin Spacing; Value: 0; Supplier 1: Digikey; Supplier 2: Mouser; Supplier Part Number 1: 541-0.0GCT-ND; Package: 0603
TP5 = TP: as TP1 on sheet Power supplies; Created: 2020_04_Kreppel; Supplier 1: Digikey; Supplier Part Number 1: 36-5006-ND; Supplier 2: Mouser; MF: Keystone
U12 = 5M570ZT100C5N: MAX V CPLD 440MC 9NS 100TQFP; Manufacturer Part-Number: 5M570ZT100C5N; Supplier 1: Digikey; Supplier 2: Mouser; Supplier Part Number 1: 544-2839-ND
U18 = TLV1117LV18DCYR: 1A Positive 1.8V Fixed-Voltage Low-Dropout Regulator; Manufacturer: Texas Instruments; Voltage Input Max: 5.5 V; Created: 2020_04_Kreppel; Supplier 1: Digikey; Supplier Part Number 1: 296-28777-1-ND; Voltage Output: 1.8 V; Current Max: 1 A; Supplier 2: Mouser; Supplier Part Number 2: 595-TLV1117LV18DCYT
X1 = Oscilador_1: Oscilador 20MHz; Manufacturer Part-Number: CB3LV-3C-20M000000; Manufacturer 1: CTS-Frequency Controls; Value: 20MHz; Supplier 1: Digikey; Supplier 2: Mouser; Supplier Part Number 1: 110-CB3LV-3C-20M000000CT-ND

## Sheet Led.SchDoc
size A4; Author: Thomas Kreppel; CompanyName: Universidad de Santiago de Chile; Address1: Avenida Ecuador Nº 3519; Address2: Estación Central, Santiago; Address3: Chile; DocumentNumber: 10; Revision: 3v01; SheetNumber: 10; SheetTotal: 10
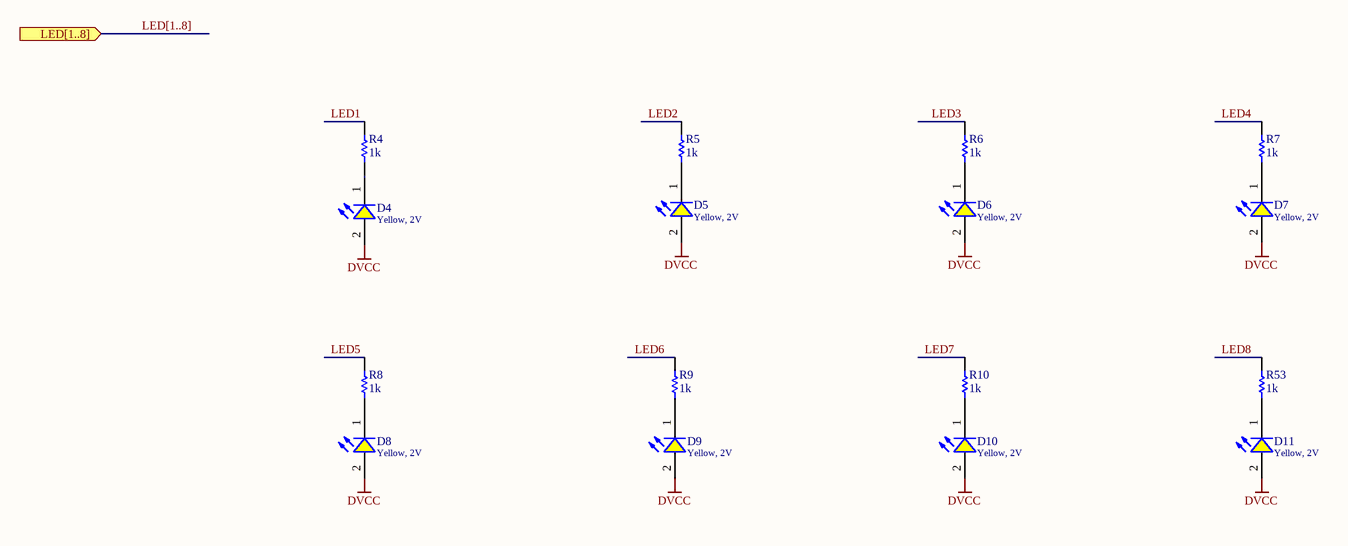
[diagram p8: Led.SchDoc]

### Parts
D4  Yellow, 2V  [WL-SMCW_0603_H=0.7mm]
D5  Yellow, 2V  [WL-SMCW_0603_H=0.7mm]
D6  Yellow, 2V  [WL-SMCW_0603_H=0.7mm]
D7  Yellow, 2V  [WL-SMCW_0603_H=0.7mm]
D8  Yellow, 2V  [WL-SMCW_0603_H=0.7mm]
D9  Yellow, 2V  [WL-SMCW_0603_H=0.7mm]
D10  Yellow, 2V  [WL-SMCW_0603_H=0.7mm]
D11  Yellow, 2V  [WL-SMCW_0603_H=0.7mm]
R4  1k  [RES_0603]
R5  1k  [RES_0603]
R6  1k  [RES_0603]
R7  1k  [RES_0603]
R8  1k  [RES_0603]
R9  1k  [RES_0603]
R10  1k  [RES_0603]
R53  1k  [RES_0603]

### Ports
LED[1..8] (in)

### Nets
DVCC: D4.2(A) D5.2(A) D6.2(A) D7.2(A) D8.2(A) D9.2(A) D10.2(A) D11.2(A)
LED1: R4.2
LED2: R5.2
LED3: R6.2
LED4: R7.2
LED5: R8.2
LED6: R9.2
LED7: R10.2
LED8: R53.2
NetD4_1: D4.1(K) R4.1
NetD5_1: D5.1(K) R5.1
NetD6_1: D6.1(K) R6.1
NetD7_1: D7.1(K) R7.1
NetD8_1: D8.1(K) R8.1
NetD9_1: D9.1(K) R9.1
NetD10_1: D10.1(K) R10.1
NetD11_1: D11.1(K) R53.1

### Buses and harness runs
bus LED[1..8] = port LED[1..8]

### Notes on the sheet
- Title
- Size:
- Date:
- A4
- Revision:
- Time:
- Sheet
- of
- Author:
- Project:

### Library data of the parts
D4-D11 = 150060YS75000: WL-SMCW SMT Mono-color Chip LED Waterclear, size 0603, Yellow, 2V, 140deg; Chip Technology: AlInGaP; Dominant Wavelength typ.: 590nm; Luminous Intensity typ.: 120mcd; Peak Wavelength typ.: 595nm; MF: Wurth Elektronik; Viewing Angle: 140deg; ComponentLink1Description: Manufacturer; ComponentLink1URL: http://www.we-online.de; ComponentLink2URL: https://www.we-online.com/catalog/datasheet/150060YS75000.pdf; ComponentLink2Description: Datasheet; Forward Voltage typ.: 2V; Emitting Color: Yellow; Mounting Technology: SMT; Operating Temperature: -40 to +85degC; Published Date: December 2019; MPN: 150060YS75000; Packaging: Tape and Reel; Package: 0603; Supplier 1: Digikey; Supplier Part Number 1: 732-4981-1-ND
R4-R10 R53 = Res0603: MPN: RC0603FR-071KL; Tolerance: 1%; Published: 8-Jun-2000; LatestRevisionDate: 17-Jul-2002; LatestRevisionNote: Re-released for DXP Platform.; PackageReference: AXIAL-0.3; Publisher: Altium Limited; PackageDescription: Axial Device, Thru-Hole; 2 Leads; 0.3 in Pin Spacing; Value: 1k; Supplier 1: Digikey; Supplier 2: Mouser; Supplier Part Number 1: 311-1.00KHRCT-ND; Package: 0603